# EAGLE design multishift (EAGLE 9.5.1)
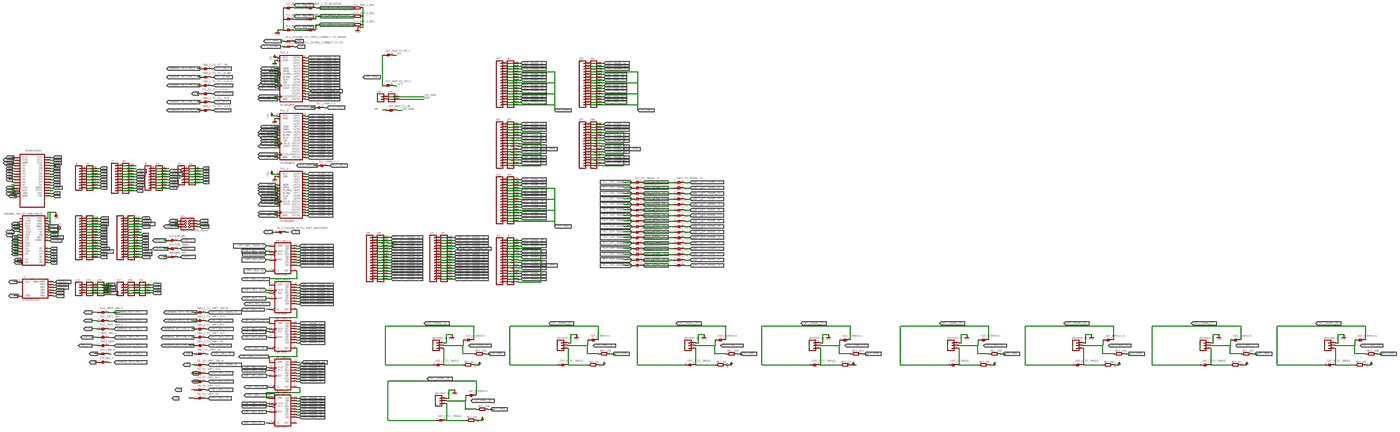
[diagram p0: schematic, sheet 1, overview]
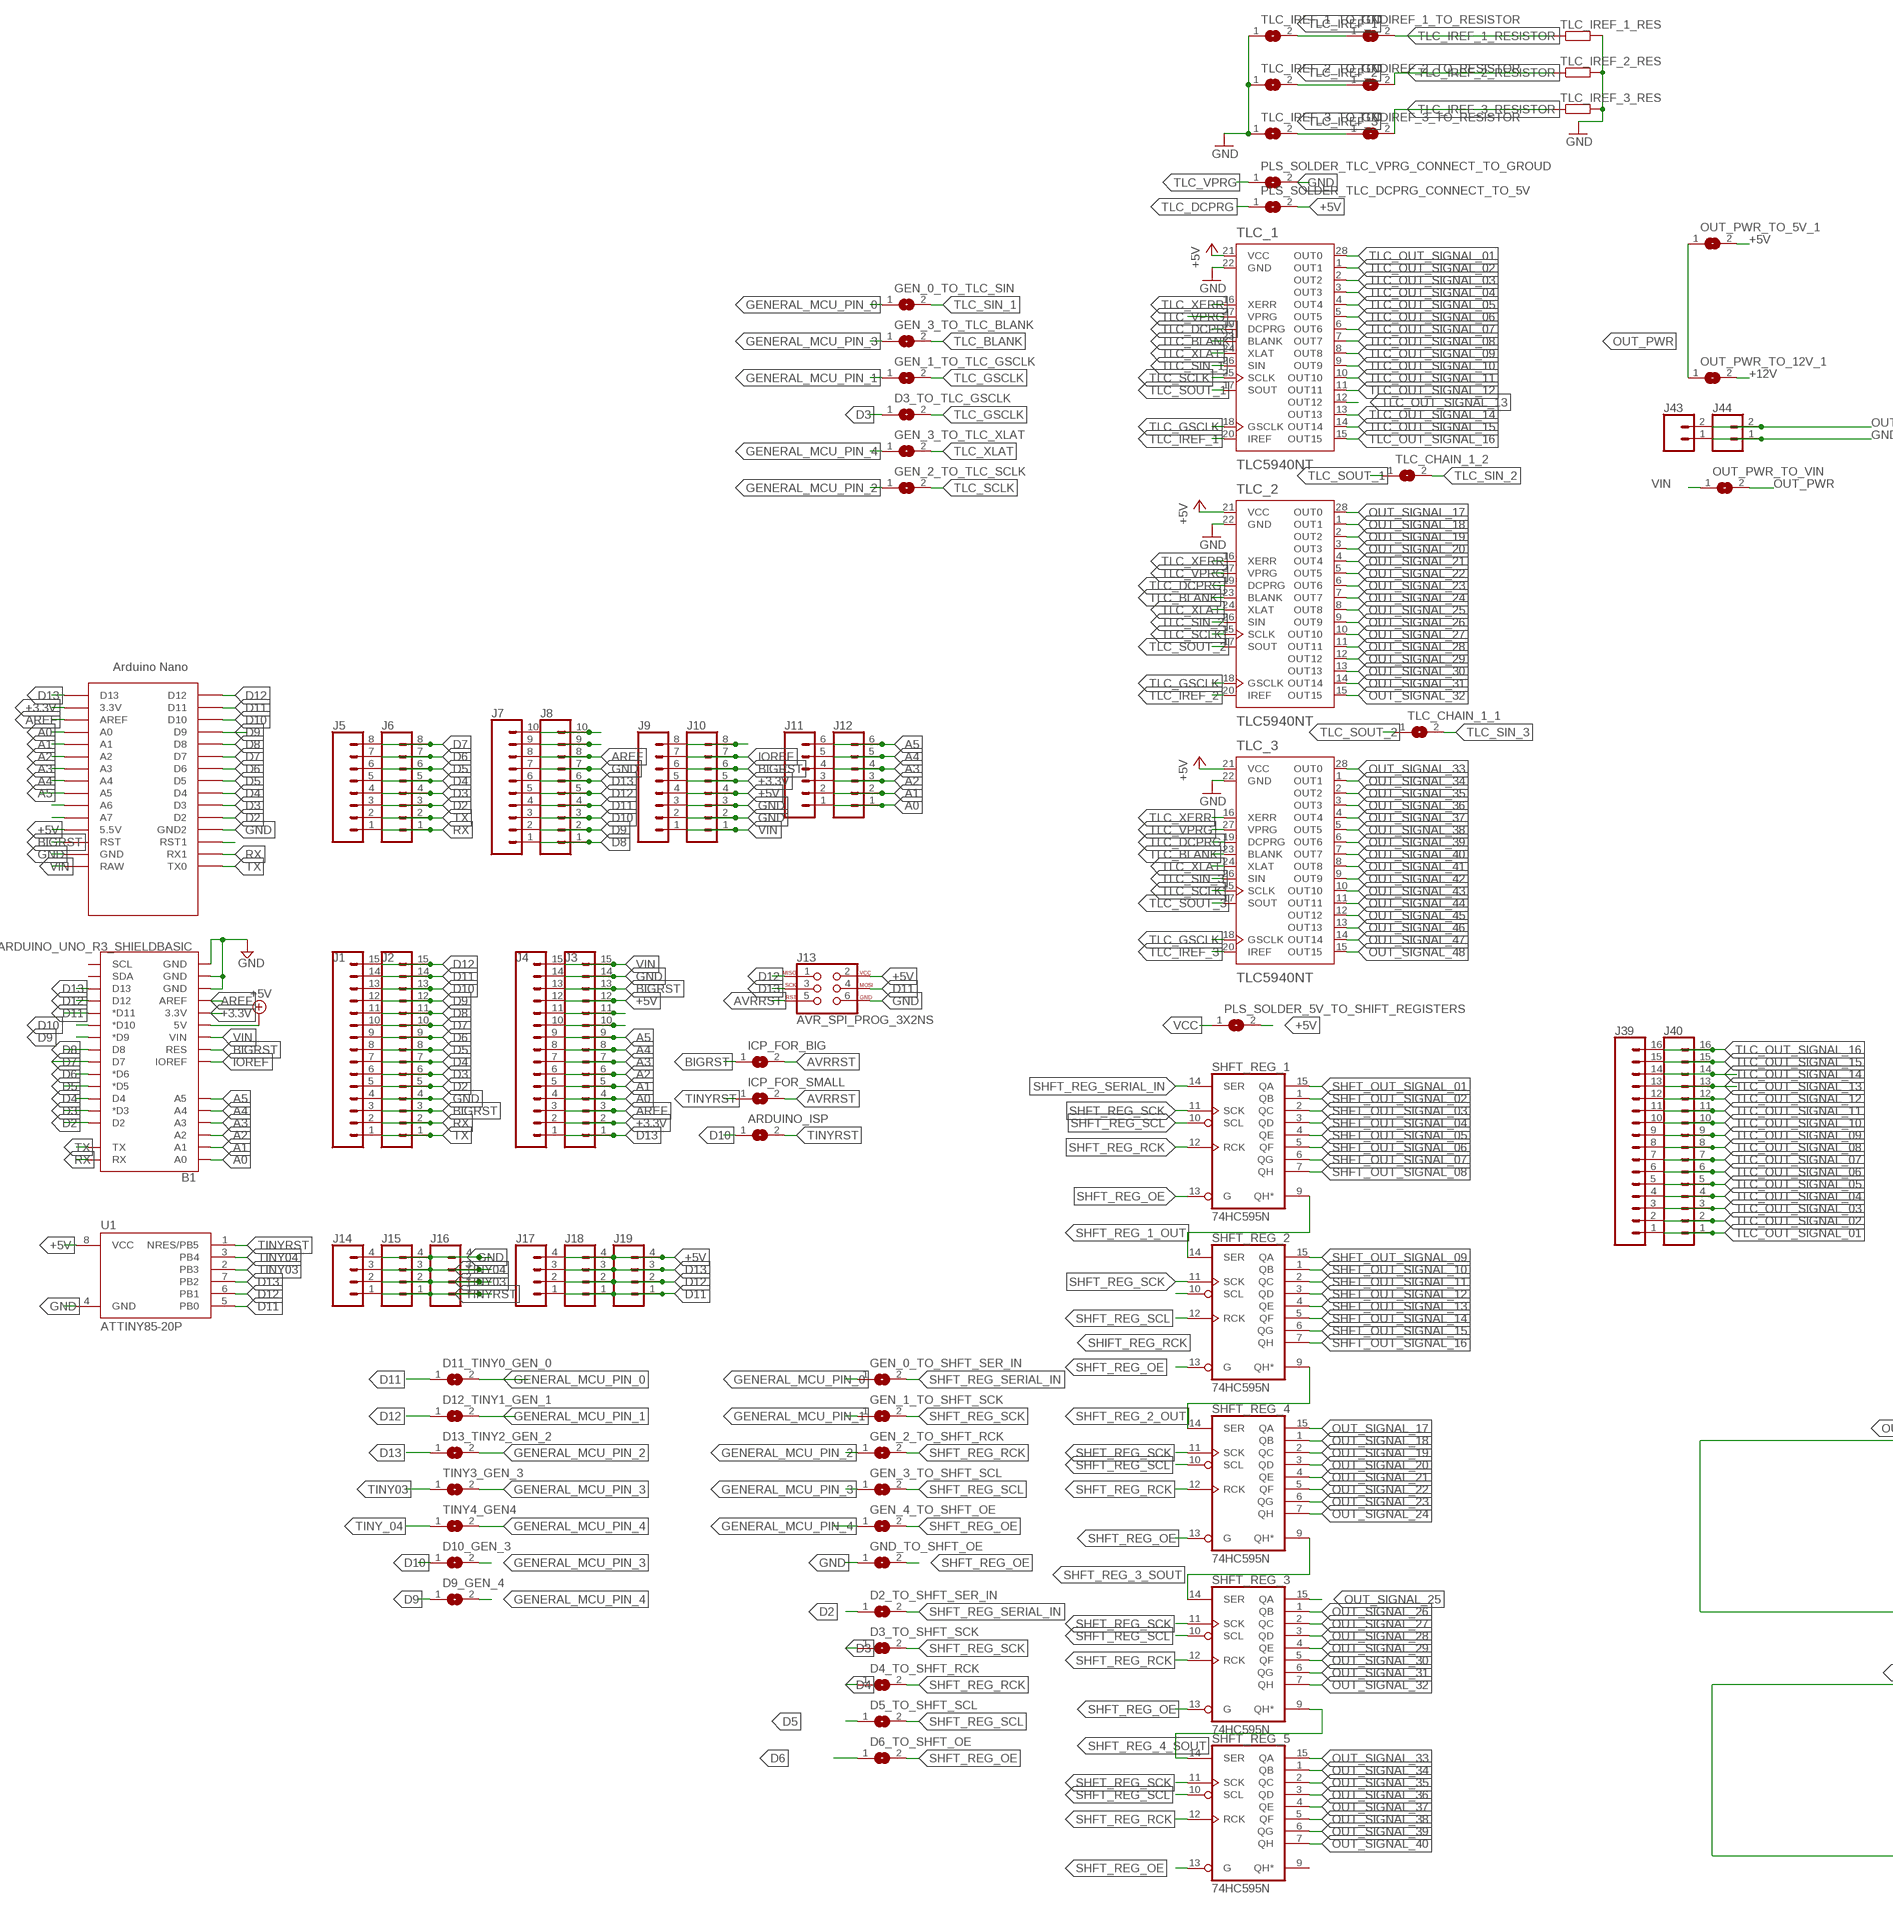
[diagram p1: schematic, sheet 1, part 1 of 4]
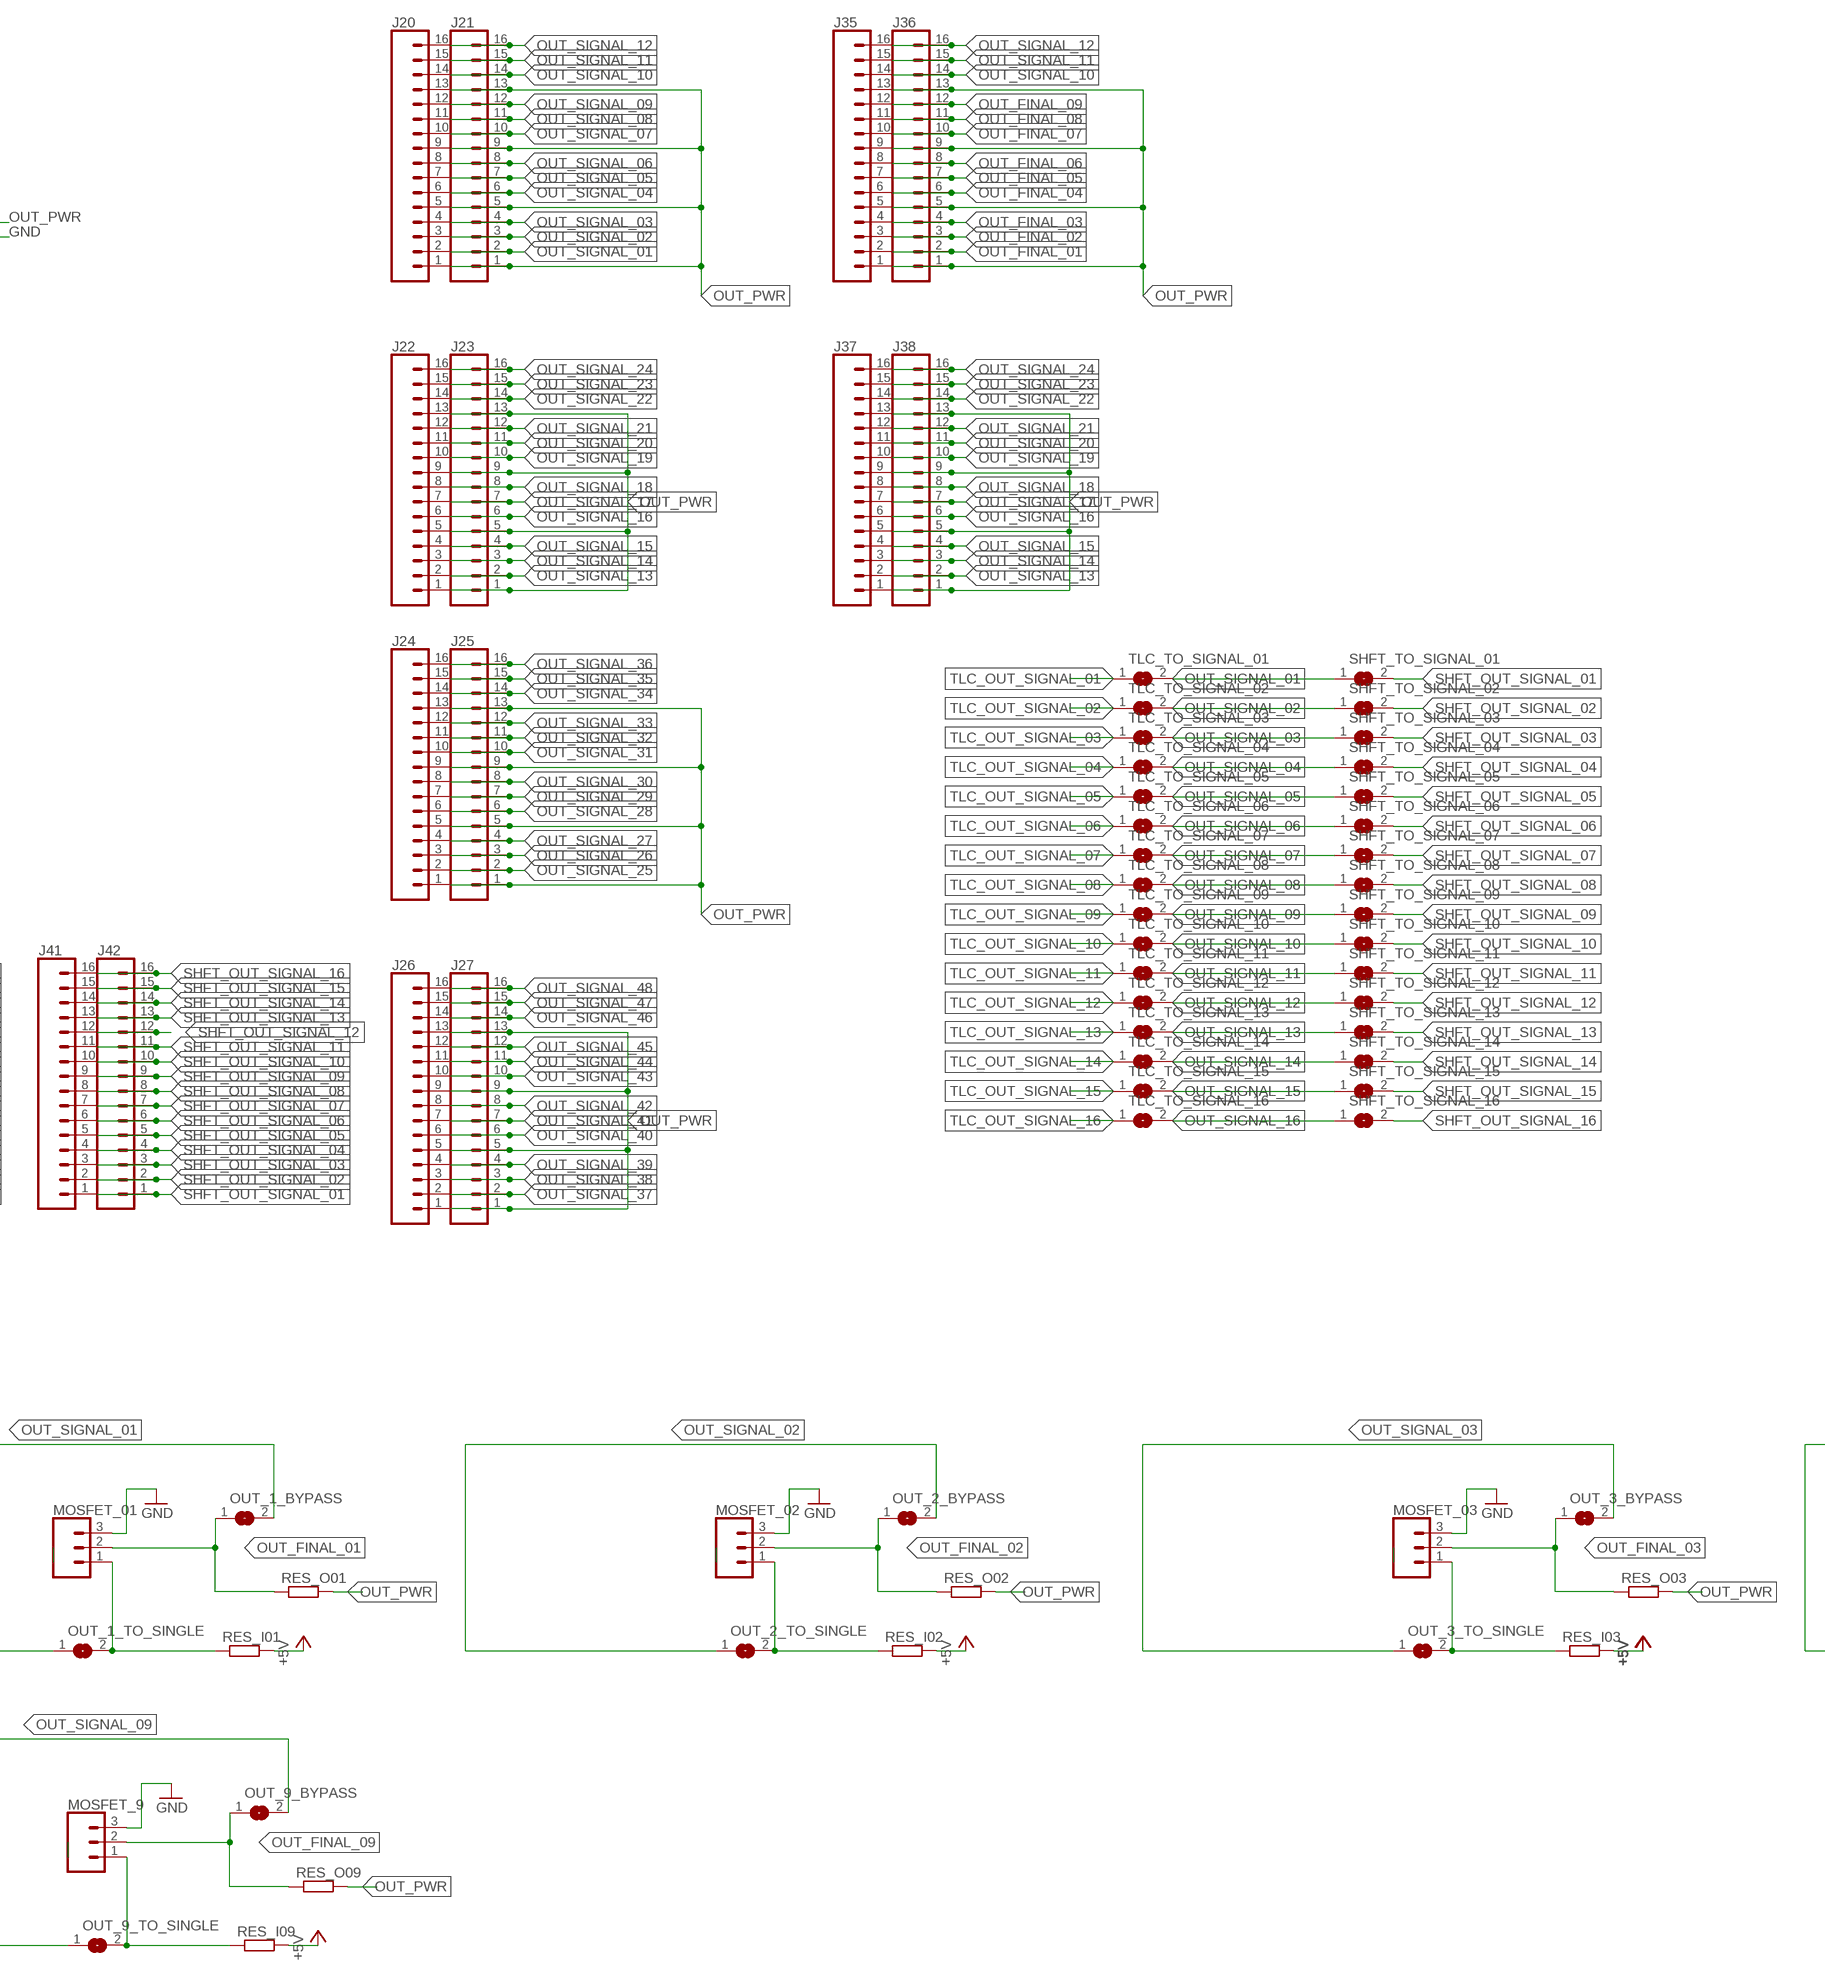
[diagram p2: schematic, sheet 1, part 2 of 4]
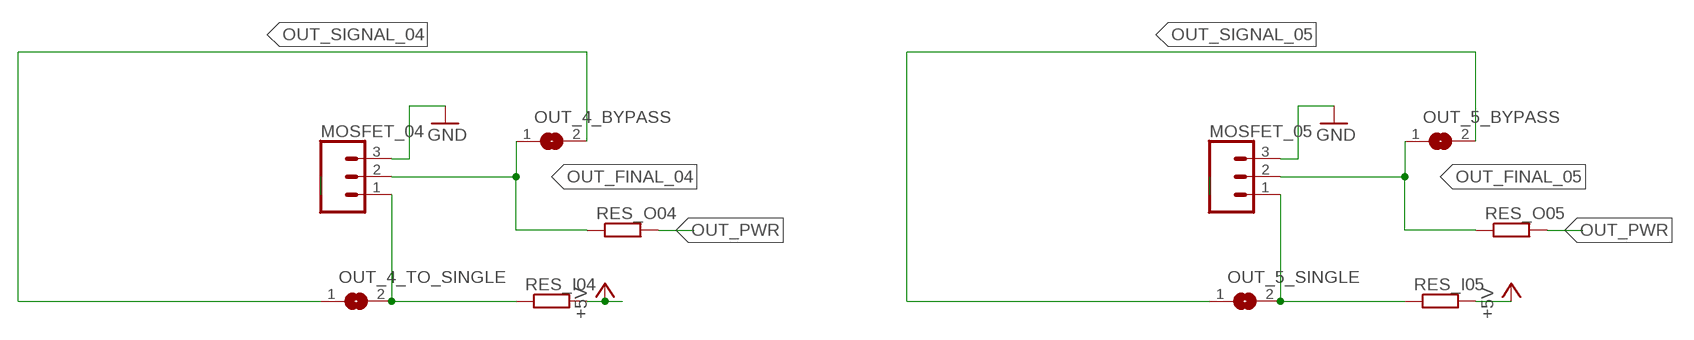
[diagram p3: schematic, sheet 1, part 3 of 4]
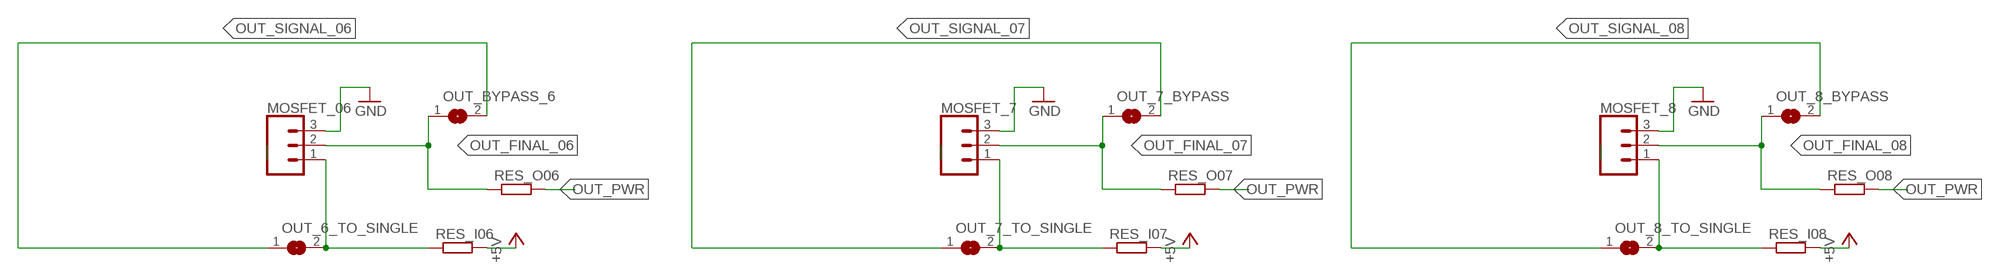
[diagram p4: schematic, sheet 1, part 4 of 4]

## Parts
ARDUINO_ISP  SJ  [SJ]
B1  ARDUINO_UNO_R3_SHIELDBASIC  [UNO_R3_SHIELD]
D2_TO_SHFT_SER_IN  SJ  [SJ]
D3_TO_SHFT_SCK  SJ  [SJ]
D3_TO_TLC_GSCLK  SJ  [SJ]
D4_TO_SHFT_RCK  SJ  [SJ]
D5_TO_SHFT_SCL  SJ  [SJ]
D6_TO_SHFT_OE  SJ  [SJ]
D9_GEN_4  SJ  [SJ]
D10_GEN_3  SJ  [SJ]
D11_TINY0_GEN_0  SJ  [SJ]
D12_TINY1_GEN_1  SJ  [SJ]
D13_TINY2_GEN_2  SJ  [SJ]
GEN_0_TO_SHFT_SER_IN  SJ  [SJ]
GEN_0_TO_TLC_SIN  SJ  [SJ]
GEN_1_TO_SHFT_SCK  SJ  [SJ]
GEN_1_TO_TLC_GSCLK  SJ  [SJ]
GEN_2_TO_SHFT_RCK  SJ  [SJ]
GEN_2_TO_TLC_SCLK  SJ  [SJ]
GEN_3_TO_SHFT_SCL  SJ  [SJ]
GEN_3_TO_TLC_BLANK  SJ  [SJ]
GEN_3_TO_TLC_XLAT  SJ  [SJ]
GEN_4_TO_SHFT_OE  SJ  [SJ]
GND_TO_SHFT_OE  SJ  [SJ]
ICP_FOR_BIG  SJ  [SJ]
ICP_FOR_SMALL  SJ  [SJ]
J1  CONN_15  [1X15]
J2  CONN_15  [1X15]
J3  CONN_15  [1X15]
J4  CONN_15  [1X15]
J5  CONN_08"  [1X08]
J6  CONN_08"  [1X08]
J7  CONN_10"  [1X10]
J8  CONN_10"  [1X10]
J9  CONN_08"  [1X08]
J10  CONN_08"  [1X08]
J11  CONN_06SILK_FEMALE_PTH  [1X06]
J12  CONN_06SILK_FEMALE_PTH  [1X06]
J13  AVR_SPI_PROG_3X2NS  [2X3-NS]
J14  CONN_04  [1X04]
J15  CONN_04  [1X04]
J16  CONN_04  [1X04]
J17  CONN_04  [1X04]
J18  CONN_04  [1X04]
J19  CONN_04  [1X04]
J20  CONN_16  [1X16]
J21  CONN_16  [1X16]
J22  CONN_16  [1X16]
J23  CONN_16  [1X16]
J24  CONN_16  [1X16]
J25  CONN_16  [1X16]
J26  CONN_16  [1X16]
J27  CONN_16  [1X16]
J35  CONN_16  [1X16]
J36  CONN_16  [1X16]
J37  CONN_16  [1X16]
J38  CONN_16  [1X16]
J39  CONN_16  [1X16]
J40  CONN_16  [1X16]
J41  CONN_16  [1X16]
J42  CONN_16  [1X16]
J43  CONN_025MM  [SCREWTERMINAL-5MM-2]
J44  CONN_025MM  [SCREWTERMINAL-5MM-2]
MOSFET_01  CONN_03  [1X03]
MOSFET_02  CONN_03  [1X03]
MOSFET_03  CONN_03  [1X03]
MOSFET_04  CONN_03  [1X03]
MOSFET_05  CONN_03  [1X03]
MOSFET_06  CONN_03  [1X03]
MOSFET_7  CONN_03  [1X03]
MOSFET_8  CONN_03  [1X03]
MOSFET_9  CONN_03  [1X03]
OUT_1_BYPASS  SJ  [SJ]
OUT_1_TO_SINGLE  SJ  [SJ]
OUT_2_BYPASS  SJ  [SJ]
OUT_2_TO_SINGLE  SJ  [SJ]
OUT_3_BYPASS  SJ  [SJ]
OUT_3_TO_SINGLE  SJ  [SJ]
OUT_4_BYPASS  SJ  [SJ]
OUT_4_TO_SINGLE  SJ  [SJ]
OUT_5_BYPASS  SJ  [SJ]
OUT_5_SINGLE  SJ  [SJ]
OUT_6_TO_SINGLE  SJ  [SJ]
OUT_7_BYPASS  SJ  [SJ]
OUT_7_TO_SINGLE  SJ  [SJ]
OUT_8_BYPASS  SJ  [SJ]
OUT_8_TO_SINGLE  SJ  [SJ]
OUT_9_BYPASS  SJ  [SJ]
OUT_9_TO_SINGLE  SJ  [SJ]
OUT_BYPASS_6  SJ  [SJ]
OUT_PWR_TO_5V_1  SJ  [SJ]
OUT_PWR_TO_12V_1  SJ  [SJ]
OUT_PWR_TO_VIN  SJ  [SJ]
PLS_SOLDER_5V_TO_SHIFT_REGISTERS  SJ  [SJ]
PLS_SOLDER_TLC_DCPRG_CONNECT_TO_5V  SJ  [SJ]
PLS_SOLDER_TLC_VPRG_CONNECT_TO_GROUD  SJ  [SJ]
RES_I01  R-EU_0204/7  [0204/7]
RES_I02  R-EU_0204/7  [0204/7]
RES_I03  R-EU_0204/7  [0204/7]
RES_I04  R-EU_0204/7  [0204/7]
RES_I05  R-EU_0204/7  [0204/7]
RES_I06  R-EU_0204/7  [0204/7]
RES_I07  R-EU_0204/7  [0204/7]
RES_I08  R-EU_0204/7  [0204/7]
RES_I09  R-EU_0204/7  [0204/7]
RES_O01  R-EU_0204/7  [0204/7]
RES_O02  R-EU_0204/7  [0204/7]
RES_O03  R-EU_0204/7  [0204/7]
RES_O04  R-EU_0204/7  [0204/7]
RES_O05  R-EU_0204/7  [0204/7]
RES_O06  R-EU_0204/7  [0204/7]
RES_O07  R-EU_0204/7  [0204/7]
RES_O08  R-EU_0204/7  [0204/7]
RES_O09  R-EU_0204/7  [0204/7]
SHFT_REG_1  74HC595N  [DIL16]
SHFT_REG_2  74HC595N  [DIL16]
SHFT_REG_3  74HC595N  [DIL16]
SHFT_REG_4  74HC595N  [DIL16]
SHFT_REG_5  74HC595N  [DIL16]
SHFT_TO_SIGNAL_01  SJ  [SJ]
SHFT_TO_SIGNAL_02  SJ  [SJ]
SHFT_TO_SIGNAL_03  SJ  [SJ]
SHFT_TO_SIGNAL_04  SJ  [SJ]
SHFT_TO_SIGNAL_05  SJ  [SJ]
SHFT_TO_SIGNAL_06  SJ  [SJ]
SHFT_TO_SIGNAL_07  SJ  [SJ]
SHFT_TO_SIGNAL_08  SJ  [SJ]
SHFT_TO_SIGNAL_09  SJ  [SJ]
SHFT_TO_SIGNAL_10  SJ  [SJ]
SHFT_TO_SIGNAL_11  SJ  [SJ]
SHFT_TO_SIGNAL_12  SJ  [SJ]
SHFT_TO_SIGNAL_13  SJ  [SJ]
SHFT_TO_SIGNAL_14  SJ  [SJ]
SHFT_TO_SIGNAL_15  SJ  [SJ]
SHFT_TO_SIGNAL_16  SJ  [SJ]
TINY3_GEN_3  SJ  [SJ]
TINY4_GEN4  SJ  [SJ]
TLC_1  TLC5940NT  [DIL28-3]
TLC_2  TLC5940NT  [DIL28-3]
TLC_3  TLC5940NT  [DIL28-3]
TLC_CHAIN_1_1  SJ  [SJ]
TLC_CHAIN_1_2  SJ  [SJ]
TLC_IREF_1_RES  R-EU_0204/7  [0204/7]
TLC_IREF_1_TO_GND  SJ  [SJ]
TLC_IREF_1_TO_RESISTOR  SJ  [SJ]
TLC_IREF_2_RES  R-EU_0204/7  [0204/7]
TLC_IREF_2_TO_GND  SJ  [SJ]
TLC_IREF_2_TO_RESISTOR  SJ  [SJ]
TLC_IREF_3_RES  R-EU_0204/7  [0204/7]
TLC_IREF_3_TO_GND  SJ  [SJ]
TLC_IREF_3_TO_RESISTOR  SJ  [SJ]
TLC_TO_SIGNAL_01  SJ  [SJ]
TLC_TO_SIGNAL_02  SJ  [SJ]
TLC_TO_SIGNAL_03  SJ  [SJ]
TLC_TO_SIGNAL_04  SJ  [SJ]
TLC_TO_SIGNAL_05  SJ  [SJ]
TLC_TO_SIGNAL_06  SJ  [SJ]
TLC_TO_SIGNAL_07  SJ  [SJ]
TLC_TO_SIGNAL_08  SJ  [SJ]
TLC_TO_SIGNAL_09  SJ  [SJ]
TLC_TO_SIGNAL_10  SJ  [SJ]
TLC_TO_SIGNAL_11  SJ  [SJ]
TLC_TO_SIGNAL_12  SJ  [SJ]
TLC_TO_SIGNAL_13  SJ  [SJ]
TLC_TO_SIGNAL_14  SJ  [SJ]
TLC_TO_SIGNAL_15  SJ  [SJ]
TLC_TO_SIGNAL_16  SJ  [SJ]
U1  ATTINY85-20P  [PDIP08_300MIL]
U$1  NANO  [NANO]

## Nets
+3.3V: B1.3.3V J3.2 J4.2 J9.5 J10.5 U$1.3.3V
+5V: B1.5V J3.12 J4.12 J9.4 J10.4 J13.2 J17.4 J18.4 J19.4 OUT_PWR_TO_5V_1.2 PLS_SOLDER_5V_TO_SHIFT_REGISTERS.2 PLS_SOLDER_TLC_DCPRG_CONNECT_TO_5V.2 RES_I01.2 RES_I02.2 RES_I03.2 RES_I04.2 RES_I05.2 RES_I06.2 RES_I07.2 RES_I08.2 RES_I09.2 TLC_1.21(VCC) TLC_2.21(VCC) TLC_3.21(VCC) U1.8(VCC) U$1.5V(5.5V)
+12V: OUT_PWR_TO_12V_1.2
A0: B1.A0 J3.4 J4.4 J11.1 J12.1 U$1.A0
A1: B1.A1 J3.5 J4.5 J11.2 J12.2 U$1.A1
A2: B1.A2 J3.6 J4.6 J11.3 J12.3 U$1.A2
A3: B1.A3 J3.7 J4.7 J11.4 J12.4 U$1.A3
A4: B1.A4 J3.8 J4.8 J11.5 J12.5 U$1.A4
A5: B1.A5 J3.9 J4.9 J11.6 J12.6 U$1.A5
AREF: B1.AREF J3.3 J4.3 J7.8 J8.8 U$1.AREF
AVRRST: ICP_FOR_BIG.2 ICP_FOR_SMALL.2 J13.5
BIGRST: B1.RES ICP_FOR_BIG.1 J1.3 J2.3 J3.13 J4.13 J9.6 J10.6 U$1.RST
D2: B1.D2 D2_TO_SHFT_SER_IN.1 J1.5 J2.5 J5.3 J6.3 U$1.D2
D3: B1.D3(*D3) D3_TO_SHFT_SCK.1 D3_TO_TLC_GSCLK.1 J1.6 J2.6 J5.4 J6.4 U$1.D3
D4: B1.D4 D4_TO_SHFT_RCK.1 J1.7 J2.7 J5.5 J6.5 U$1.D4
D5: B1.D5(*D5) D5_TO_SHFT_SCL.1 J1.8 J2.8 J5.6 J6.6 U$1.D5
D6: B1.D6(*D6) D6_TO_SHFT_OE.1 J1.9 J2.9 J5.7 J6.7 U$1.D6
D7: B1.D7 J1.10 J2.10 J5.8 J6.8 U$1.D7
D8: B1.D8 J1.11 J2.11 J7.1 J8.1 U$1.D8
D9: B1.D9(*D9) D9_GEN_4.1 J1.12 J2.12 J7.2 J8.2 U$1.D9
D10: ARDUINO_ISP.1 B1.D10(*D10) D10_GEN_3.1 J1.13 J2.13 J7.3 J8.3 U$1.D10
D11: B1.D11(*D11) D11_TINY0_GEN_0.1 J1.14 J2.14 J7.4 J8.4 J13.4 J17.1 J18.1 J19.1 U1.5(PB0) U$1.D11
D12: B1.D12 D12_TINY1_GEN_1.1 J1.15 J2.15 J7.5 J8.5 J13.1 J17.2 J18.2 J19.2 U1.6(PB1) U$1.D12
D13: B1.D13 D13_TINY2_GEN_2.1 J3.1 J4.1 J7.6 J8.6 J13.3 J17.3 J18.3 J19.3 U1.7(PB2) U$1.D13
GENERAL_MCU_PIN_0: D11_TINY0_GEN_0.2 GEN_0_TO_SHFT_SER_IN.1 GEN_0_TO_TLC_SIN.1
GENERAL_MCU_PIN_1: D12_TINY1_GEN_1.2 GEN_1_TO_SHFT_SCK.1 GEN_1_TO_TLC_GSCLK.1
GENERAL_MCU_PIN_2: D13_TINY2_GEN_2.2 GEN_2_TO_SHFT_RCK.1 GEN_2_TO_TLC_SCLK.1
GENERAL_MCU_PIN_3: D10_GEN_3.2 GEN_3_TO_SHFT_SCL.1 GEN_3_TO_TLC_BLANK.1 TINY3_GEN_3.2
GENERAL_MCU_PIN_4: D9_GEN_4.2 GEN_3_TO_TLC_XLAT.1 GEN_4_TO_SHFT_OE.1 TINY4_GEN4.2
GND: B1.GND@0(GND) B1.GND@1(GND) B1.GND@2(GND) GND_TO_SHFT_OE.1 J1.4 J2.4 J3.14 J4.14 J7.7 J8.7 J9.2 J9.3 J10.2 J10.3 J13.6 J14.4 J15.4 J16.4 J43.1 J44.1 MOSFET_01.3 MOSFET_02.3 MOSFET_03.3 MOSFET_04.3 MOSFET_05.3 MOSFET_06.3 MOSFET_7.3 MOSFET_8.3 MOSFET_9.3 PLS_SOLDER_TLC_VPRG_CONNECT_TO_GROUD.2 TLC_1.22(GND) TLC_2.22(GND) TLC_3.22(GND) TLC_IREF_1_RES.2 TLC_IREF_1_TO_GND.1 TLC_IREF_2_RES.2 TLC_IREF_2_TO_GND.1 TLC_IREF_3_RES.2 TLC_IREF_3_TO_GND.1 U1.4(GND) U$1.GND U$1.GND1(GND2)
IOREF: B1.IOREF J9.7 J10.7
N$1: J9.8 J10.8
N$5: J3.11 J4.11
N$6: J3.10 J4.10
N$11: U$1.A6
N$12: U$1.A7
N$14: J7.9 J8.9
N$15: J7.10 J8.10
N$21: U$1.RST1
N$50: MOSFET_01.1 OUT_1_TO_SINGLE.2 RES_I01.1
N$51: MOSFET_9.1 OUT_9_TO_SINGLE.2 RES_I09.1
N$54: MOSFET_02.1 OUT_2_TO_SINGLE.2 RES_I02.1
N$66: MOSFET_03.1 OUT_3_TO_SINGLE.2 RES_I03.1
N$70: MOSFET_04.1 OUT_4_TO_SINGLE.2 RES_I04.1
N$178: MOSFET_05.1 OUT_5_SINGLE.2 RES_I05.1
N$182: MOSFET_06.1 OUT_6_TO_SINGLE.2 RES_I06.1
N$194: MOSFET_7.1 OUT_7_TO_SINGLE.2 RES_I07.1
N$198: MOSFET_8.1 OUT_8_TO_SINGLE.2 RES_I08.1
OUT_FINAL_01: J35.2 J36.2 MOSFET_01.2 OUT_1_BYPASS.1 RES_O01.1
OUT_FINAL_02: J35.3 J36.3 MOSFET_02.2 OUT_2_BYPASS.1 RES_O02.1
OUT_FINAL_03: J35.4 J36.4 MOSFET_03.2 OUT_3_BYPASS.1 RES_O03.1
OUT_FINAL_04: J35.6 J36.6 MOSFET_04.2 OUT_4_BYPASS.1 RES_O04.1
OUT_FINAL_05: J35.7 J36.7 MOSFET_05.2 OUT_5_BYPASS.1 RES_O05.1
OUT_FINAL_06: J35.8 J36.8 MOSFET_06.2 OUT_BYPASS_6.1 RES_O06.1
OUT_FINAL_07: J35.10 J36.10 MOSFET_7.2 OUT_7_BYPASS.1 RES_O07.1
OUT_FINAL_08: J35.11 J36.11 MOSFET_8.2 OUT_8_BYPASS.1 RES_O08.1
OUT_FINAL_09: J35.12 J36.12 MOSFET_9.2 OUT_9_BYPASS.1 RES_O09.1
OUT_PWR: J20.1 J20.5 J20.9 J20.13 J21.1 J21.5 J21.9 J21.13 J22.1 J22.5 J22.9 J22.13 J23.1 J23.5 J23.9 J23.13 J24.1 J24.5 J24.9 J24.13 J25.1 J25.5 J25.9 J25.13 J26.1 J26.5 J26.9 J26.13 J27.1 J27.5 J27.9 J27.13 J35.1 J35.5 J35.9 J35.13 J36.1 J36.5 J36.9 J36.13 J37.1 J37.5 J37.9 J37.13 J38.1 J38.5 J38.9 J38.13 J43.2 J44.2 OUT_PWR_TO_5V_1.1 OUT_PWR_TO_12V_1.1 OUT_PWR_TO_VIN.2 RES_O01.2 RES_O02.2 RES_O03.2 RES_O04.2 RES_O05.2 RES_O06.2 RES_O07.2 RES_O08.2 RES_O09.2
OUT_SIGNAL_01: J20.2 J21.2 OUT_1_BYPASS.2 OUT_1_TO_SINGLE.1 SHFT_TO_SIGNAL_01.1 TLC_TO_SIGNAL_01.2
OUT_SIGNAL_02: J20.3 J21.3 OUT_2_BYPASS.2 OUT_2_TO_SINGLE.1 SHFT_TO_SIGNAL_02.1 TLC_TO_SIGNAL_02.2
OUT_SIGNAL_03: J20.4 J21.4 OUT_3_BYPASS.2 OUT_3_TO_SINGLE.1 SHFT_TO_SIGNAL_03.1 TLC_TO_SIGNAL_03.2
OUT_SIGNAL_04: J20.6 J21.6 OUT_4_BYPASS.2 OUT_4_TO_SINGLE.1 SHFT_TO_SIGNAL_04.1 TLC_TO_SIGNAL_04.2
OUT_SIGNAL_05: J20.7 J21.7 OUT_5_BYPASS.2 OUT_5_SINGLE.1 SHFT_TO_SIGNAL_05.1 TLC_TO_SIGNAL_05.2
OUT_SIGNAL_06: J20.8 J21.8 OUT_6_TO_SINGLE.1 OUT_BYPASS_6.2 SHFT_TO_SIGNAL_06.1 TLC_TO_SIGNAL_06.2
OUT_SIGNAL_07: J20.10 J21.10 OUT_7_BYPASS.2 OUT_7_TO_SINGLE.1 SHFT_TO_SIGNAL_07.1 TLC_TO_SIGNAL_07.2
OUT_SIGNAL_08: J20.11 J21.11 OUT_8_BYPASS.2 OUT_8_TO_SINGLE.1 SHFT_TO_SIGNAL_08.1 TLC_TO_SIGNAL_08.2
OUT_SIGNAL_09: J20.12 J21.12 OUT_9_BYPASS.2 OUT_9_TO_SINGLE.1 SHFT_TO_SIGNAL_09.1 TLC_TO_SIGNAL_09.2
OUT_SIGNAL_10: J20.14 J21.14 J35.14 J36.14 SHFT_TO_SIGNAL_10.1 TLC_TO_SIGNAL_10.2
OUT_SIGNAL_11: J20.15 J21.15 J35.15 J36.15 SHFT_TO_SIGNAL_11.1 TLC_TO_SIGNAL_11.2
OUT_SIGNAL_12: J20.16 J21.16 J35.16 J36.16 SHFT_TO_SIGNAL_12.1 TLC_TO_SIGNAL_12.2
OUT_SIGNAL_13: J22.2 J23.2 J37.2 J38.2 SHFT_TO_SIGNAL_13.1 TLC_TO_SIGNAL_13.2
OUT_SIGNAL_14: J22.3 J23.3 J37.3 J38.3 SHFT_TO_SIGNAL_14.1 TLC_TO_SIGNAL_14.2
OUT_SIGNAL_15: J22.4 J23.4 J37.4 J38.4 SHFT_TO_SIGNAL_15.1 TLC_TO_SIGNAL_15.2
OUT_SIGNAL_16: J22.6 J23.6 J37.6 J38.6 SHFT_TO_SIGNAL_16.1 TLC_TO_SIGNAL_16.2
OUT_SIGNAL_17: J22.7 J23.7 J37.7 J38.7 SHFT_REG_4.15(QA) TLC_2.28(OUT0)
OUT_SIGNAL_18: J22.8 J23.8 J37.8 J38.8 SHFT_REG_4.1(QB) TLC_2.1(OUT1)
OUT_SIGNAL_19: J22.10 J23.10 J37.10 J38.10 SHFT_REG_4.2(QC) TLC_2.2(OUT2)
OUT_SIGNAL_20: J22.11 J23.11 J37.11 J38.11 SHFT_REG_4.3(QD) TLC_2.3(OUT3)
OUT_SIGNAL_21: J22.12 J23.12 J37.12 J38.12 SHFT_REG_4.4(QE) TLC_2.4(OUT4)
OUT_SIGNAL_22: J22.14 J23.14 J37.14 J38.14 SHFT_REG_4.5(QF) TLC_2.5(OUT5)
OUT_SIGNAL_23: J22.15 J23.15 J37.15 J38.15 SHFT_REG_4.6(QG) TLC_2.6(OUT6)
OUT_SIGNAL_24: J22.16 J23.16 J37.16 J38.16 SHFT_REG_4.7(QH) TLC_2.7(OUT7)
OUT_SIGNAL_25: J24.2 J25.2 SHFT_REG_3.15(QA) TLC_2.8(OUT8)
OUT_SIGNAL_26: J24.3 J25.3 SHFT_REG_3.1(QB) TLC_2.9(OUT9)
OUT_SIGNAL_27: J24.4 J25.4 SHFT_REG_3.2(QC) TLC_2.10(OUT10)
OUT_SIGNAL_28: J24.6 J25.6 SHFT_REG_3.3(QD) TLC_2.11(OUT11)
OUT_SIGNAL_29: J24.7 J25.7 SHFT_REG_3.4(QE) TLC_2.12(OUT12)
OUT_SIGNAL_30: J24.8 J25.8 SHFT_REG_3.5(QF) TLC_2.13(OUT13)
OUT_SIGNAL_31: J24.10 J25.10 SHFT_REG_3.6(QG) TLC_2.14(OUT14)
OUT_SIGNAL_32: J24.11 J25.11 SHFT_REG_3.7(QH) TLC_2.15(OUT15)
OUT_SIGNAL_33: J24.12 J25.12 SHFT_REG_5.15(QA) TLC_3.28(OUT0)
OUT_SIGNAL_34: J24.14 J25.14 SHFT_REG_5.1(QB) TLC_3.1(OUT1)
OUT_SIGNAL_35: J24.15 J25.15 SHFT_REG_5.2(QC) TLC_3.2(OUT2)
OUT_SIGNAL_36: J24.16 J25.16 SHFT_REG_5.3(QD) TLC_3.3(OUT3)
OUT_SIGNAL_37: J26.2 J27.2 SHFT_REG_5.4(QE) TLC_3.4(OUT4)
OUT_SIGNAL_38: J26.3 J27.3 SHFT_REG_5.5(QF) TLC_3.5(OUT5)
OUT_SIGNAL_39: J26.4 J27.4 SHFT_REG_5.6(QG) TLC_3.6(OUT6)
OUT_SIGNAL_40: J26.6 J27.6 SHFT_REG_5.7(QH) TLC_3.7(OUT7)
OUT_SIGNAL_41: J26.7 J27.7 TLC_3.8(OUT8)
OUT_SIGNAL_42: J26.8 J27.8 TLC_3.9(OUT9)
OUT_SIGNAL_43: J26.10 J27.10 TLC_3.10(OUT10)
OUT_SIGNAL_44: J26.11 J27.11 TLC_3.11(OUT11)
OUT_SIGNAL_45: J26.12 J27.12 TLC_3.12(OUT12)
OUT_SIGNAL_46: J26.14 J27.14 TLC_3.13(OUT13)
OUT_SIGNAL_47: J26.15 J27.15 TLC_3.14(OUT14)
OUT_SIGNAL_48: J26.16 J27.16 TLC_3.15(OUT15)
RX: B1.RX J1.2 J2.2 J5.1 J6.1 U$1.RX1
SHFT_OUT_SIGNAL_01: J41.1 J42.1 SHFT_REG_1.15(QA) SHFT_TO_SIGNAL_01.2
SHFT_OUT_SIGNAL_02: J41.2 J42.2 SHFT_REG_1.1(QB) SHFT_TO_SIGNAL_02.2
SHFT_OUT_SIGNAL_03: J41.3 J42.3 SHFT_REG_1.2(QC) SHFT_TO_SIGNAL_03.2
SHFT_OUT_SIGNAL_04: J41.4 J42.4 SHFT_REG_1.3(QD) SHFT_TO_SIGNAL_04.2
SHFT_OUT_SIGNAL_05: J41.5 J42.5 SHFT_REG_1.4(QE) SHFT_TO_SIGNAL_05.2
SHFT_OUT_SIGNAL_06: J41.6 J42.6 SHFT_REG_1.5(QF) SHFT_TO_SIGNAL_06.2
SHFT_OUT_SIGNAL_07: J41.7 J42.7 SHFT_REG_1.6(QG) SHFT_TO_SIGNAL_07.2
SHFT_OUT_SIGNAL_08: J41.8 J42.8 SHFT_REG_1.7(QH) SHFT_TO_SIGNAL_08.2
SHFT_OUT_SIGNAL_09: J41.9 J42.9 SHFT_REG_2.15(QA) SHFT_TO_SIGNAL_09.2
SHFT_OUT_SIGNAL_10: J41.10 J42.10 SHFT_REG_2.1(QB) SHFT_TO_SIGNAL_10.2
SHFT_OUT_SIGNAL_11: J41.11 J42.11 SHFT_REG_2.2(QC) SHFT_TO_SIGNAL_11.2
SHFT_OUT_SIGNAL_12: J41.12 J42.12 SHFT_REG_2.3(QD) SHFT_TO_SIGNAL_12.2
SHFT_OUT_SIGNAL_13: J41.13 J42.13 SHFT_REG_2.4(QE) SHFT_TO_SIGNAL_13.2
SHFT_OUT_SIGNAL_14: J41.14 J42.14 SHFT_REG_2.5(QF) SHFT_TO_SIGNAL_14.2
SHFT_OUT_SIGNAL_15: J41.15 J42.15 SHFT_REG_2.6(QG) SHFT_TO_SIGNAL_15.2
SHFT_OUT_SIGNAL_16: J41.16 J42.16 SHFT_REG_2.7(QH) SHFT_TO_SIGNAL_16.2
SHFT_REG_1_OUT: SHFT_REG_1.9(QH*) SHFT_REG_2.14(SER)
SHFT_REG_2_OUT: SHFT_REG_2.9(QH*) SHFT_REG_4.14(SER)
SHFT_REG_3_SOUT: SHFT_REG_3.14(SER) SHFT_REG_4.9(QH*)
SHFT_REG_4_SOUT: SHFT_REG_3.9(QH*) SHFT_REG_5.14(SER)
SHFT_REG_OE: D6_TO_SHFT_OE.2 GEN_4_TO_SHFT_OE.2 GND_TO_SHFT_OE.2 SHFT_REG_1.13(G) SHFT_REG_2.13(G) SHFT_REG_3.13(G) SHFT_REG_4.13(G) SHFT_REG_5.13(G)
SHFT_REG_RCK: D4_TO_SHFT_RCK.2 GEN_2_TO_SHFT_RCK.2 SHFT_REG_1.12(RCK) SHFT_REG_3.12(RCK) SHFT_REG_4.12(RCK) SHFT_REG_5.12(RCK)
SHFT_REG_SCK: D3_TO_SHFT_SCK.2 GEN_1_TO_SHFT_SCK.2 SHFT_REG_1.11(SCK) SHFT_REG_2.11(SCK) SHFT_REG_3.11(SCK) SHFT_REG_4.11(SCK) SHFT_REG_5.11(SCK)
SHFT_REG_SCL: D5_TO_SHFT_SCL.2 GEN_3_TO_SHFT_SCL.2 SHFT_REG_1.10(SCL) SHFT_REG_2.10(SCL) SHFT_REG_3.10(SCL) SHFT_REG_4.10(SCL) SHFT_REG_5.10(SCL)
SHFT_REG_SERIAL_IN: D2_TO_SHFT_SER_IN.2 GEN_0_TO_SHFT_SER_IN.2 SHFT_REG_1.14(SER)
SHIFT_REG_RCK: SHFT_REG_2.12(RCK)
TINY03: J14.2 J15.2 J16.2 TINY3_GEN_3.1 U1.2(PB3)
TINY04: J14.3 J15.3 J16.3 U1.3(PB4)
TINY_04: TINY4_GEN4.1
TINYRST: ARDUINO_ISP.2 ICP_FOR_SMALL.1 J14.1 J15.1 J16.1 U1.1(NRES/PB5)
TLC_BLANK: GEN_3_TO_TLC_BLANK.2 TLC_1.23(BLANK) TLC_2.23(BLANK) TLC_3.23(BLANK)
TLC_DCPRG: PLS_SOLDER_TLC_DCPRG_CONNECT_TO_5V.1 TLC_1.19(DCPRG) TLC_2.19(DCPRG) TLC_3.19(DCPRG)
TLC_GSCLK: D3_TO_TLC_GSCLK.2 GEN_1_TO_TLC_GSCLK.2 TLC_1.18(GSCLK) TLC_2.18(GSCLK) TLC_3.18(GSCLK)
TLC_IREF_1: TLC_1.20(IREF) TLC_IREF_1_TO_GND.2 TLC_IREF_1_TO_RESISTOR.1
TLC_IREF_1_RESISTOR: TLC_IREF_1_RES.1 TLC_IREF_1_TO_RESISTOR.2
TLC_IREF_2: TLC_2.20(IREF) TLC_IREF_2_TO_GND.2 TLC_IREF_2_TO_RESISTOR.1
TLC_IREF_2_RESISTOR: TLC_IREF_2_RES.1 TLC_IREF_2_TO_RESISTOR.2
TLC_IREF_3: TLC_3.20(IREF) TLC_IREF_3_TO_GND.2 TLC_IREF_3_TO_RESISTOR.1
TLC_IREF_3_RESISTOR: TLC_IREF_3_RES.1 TLC_IREF_3_TO_RESISTOR.2
TLC_OUT_SIGNAL_01: J39.1 J40.1 TLC_1.28(OUT0) TLC_TO_SIGNAL_01.1
TLC_OUT_SIGNAL_02: J39.2 J40.2 TLC_1.1(OUT1) TLC_TO_SIGNAL_02.1
TLC_OUT_SIGNAL_03: J39.3 J40.3 TLC_1.2(OUT2) TLC_TO_SIGNAL_03.1
TLC_OUT_SIGNAL_04: J39.4 J40.4 TLC_1.3(OUT3) TLC_TO_SIGNAL_04.1
TLC_OUT_SIGNAL_05: J39.5 J40.5 TLC_1.4(OUT4) TLC_TO_SIGNAL_05.1
TLC_OUT_SIGNAL_06: J39.6 J40.6 TLC_1.5(OUT5) TLC_TO_SIGNAL_06.1
TLC_OUT_SIGNAL_07: J39.7 J40.7 TLC_1.6(OUT6) TLC_TO_SIGNAL_07.1
TLC_OUT_SIGNAL_08: J39.8 J40.8 TLC_1.7(OUT7) TLC_TO_SIGNAL_08.1
TLC_OUT_SIGNAL_09: J39.9 J40.9 TLC_1.8(OUT8) TLC_TO_SIGNAL_09.1
TLC_OUT_SIGNAL_10: J39.10 J40.10 TLC_1.9(OUT9) TLC_TO_SIGNAL_10.1
TLC_OUT_SIGNAL_11: J39.11 J40.11 TLC_1.10(OUT10) TLC_TO_SIGNAL_11.1
TLC_OUT_SIGNAL_12: J39.12 J40.12 TLC_1.11(OUT11) TLC_TO_SIGNAL_12.1
TLC_OUT_SIGNAL_13: J39.13 J40.13 TLC_1.12(OUT12) TLC_TO_SIGNAL_13.1
TLC_OUT_SIGNAL_14: J39.14 J40.14 TLC_1.13(OUT13) TLC_TO_SIGNAL_14.1
TLC_OUT_SIGNAL_15: J39.15 J40.15 TLC_1.14(OUT14) TLC_TO_SIGNAL_15.1
TLC_OUT_SIGNAL_16: J39.16 J40.16 TLC_1.15(OUT15) TLC_TO_SIGNAL_16.1
TLC_SCLK: GEN_2_TO_TLC_SCLK.2 TLC_1.25(SCLK) TLC_2.25(SCLK) TLC_3.25(SCLK)
TLC_SIN_1: GEN_0_TO_TLC_SIN.2 TLC_1.26(SIN)
TLC_SIN_2: TLC_2.26(SIN) TLC_CHAIN_1_2.2
TLC_SIN_3: TLC_3.26(SIN) TLC_CHAIN_1_1.2
TLC_SOUT_1: TLC_1.17(SOUT) TLC_CHAIN_1_2.1
TLC_SOUT_2: TLC_2.17(SOUT) TLC_CHAIN_1_1.1
TLC_SOUT_3: TLC_3.17(SOUT)
TLC_VPRG: PLS_SOLDER_TLC_VPRG_CONNECT_TO_GROUD.1 TLC_1.27(VPRG) TLC_2.27(VPRG) TLC_3.27(VPRG)
TLC_XERR: TLC_1.16(XERR) TLC_2.16(XERR) TLC_3.16(XERR)
TLC_XLAT: GEN_3_TO_TLC_XLAT.2 TLC_1.24(XLAT) TLC_2.24(XLAT) TLC_3.24(XLAT)
TX: B1.TX J1.1 J2.1 J5.2 J6.2 U$1.TX0
VCC: PLS_SOLDER_5V_TO_SHIFT_REGISTERS.1
VIN: B1.VIN J3.15 J4.15 J9.1 J10.1 OUT_PWR_TO_VIN.1 U$1.RAW
Unconnected: B1.SCL B1.SDA SHFT_REG_5.9(QH*) U$1.ICSP1 U$1.ICSP2 U$1.ICSP3 U$1.ICSP4 U$1.ICSP5 U$1.ICSP6

## Power pins joined to a net without a drawn wire
GND: SHFT_REG_1.8(GND) SHFT_REG_2.8(GND) SHFT_REG_3.8(GND) SHFT_REG_4.8(GND) SHFT_REG_5.8(GND)
VCC: SHFT_REG_1.16(VCC) SHFT_REG_2.16(VCC) SHFT_REG_3.16(VCC) SHFT_REG_4.16(VCC) SHFT_REG_5.16(VCC)

## Library data of the parts
ARDUINO_ISP D2_TO_SHFT_SER_IN D3_TO_SHFT_SCK D3_TO_TLC_GSCLK D4_TO_SHFT_RCK D5_TO_SHFT_SCL D6_TO_SHFT_OE D9_GEN_4 D10_GEN_3 D11_TINY0_GEN_0 D12_TINY1_GEN_1 D13_TINY2_GEN_2 GEN_0_TO_SHFT_SER_IN GEN_0_TO_TLC_SIN GEN_1_TO_SHFT_SCK GEN_1_TO_TLC_GSCLK GEN_2_TO_SHFT_RCK GEN_2_TO_TLC_SCLK GEN_3_TO_SHFT_SCL GEN_3_TO_TLC_BLANK GEN_3_TO_TLC_XLAT GEN_4_TO_SHFT_OE GND_TO_SHFT_OE ICP_FOR_BIG ICP_FOR_SMALL OUT_1_BYPASS OUT_1_TO_SINGLE OUT_2_BYPASS OUT_2_TO_SINGLE OUT_3_BYPASS OUT_3_TO_SINGLE OUT_4_BYPASS OUT_4_TO_SINGLE OUT_5_BYPASS OUT_5_SINGLE OUT_6_TO_SINGLE OUT_7_BYPASS OUT_7_TO_SINGLE OUT_8_BYPASS OUT_8_TO_SINGLE OUT_9_BYPASS OUT_9_TO_SINGLE OUT_BYPASS_6 OUT_PWR_TO_5V_1 OUT_PWR_TO_12V_1 OUT_PWR_TO_VIN PLS_SOLDER_5V_TO_SHIFT_REGISTERS PLS_SOLDER_TLC_DCPRG_CONNECT_TO_5V PLS_SOLDER_TLC_VPRG_CONNECT_TO_GROUD SHFT_TO_SIGNAL_01-SHFT_TO_SIGNAL_09 SHFT_TO_SIGNAL_10-SHFT_TO_SIGNAL_16 TINY3_GEN_3 TINY4_GEN4 TLC_CHAIN_1_1 TLC_CHAIN_1_2 TLC_IREF_1_TO_GND TLC_IREF_1_TO_RESISTOR TLC_IREF_2_TO_GND TLC_IREF_2_TO_RESISTOR TLC_IREF_3_TO_GND TLC_IREF_3_TO_RESISTOR TLC_TO_SIGNAL_01-TLC_TO_SIGNAL_09 TLC_TO_SIGNAL_10-TLC_TO_SIGNAL_16 = jumper:SJ: SMD solder JUMPER
B1 = SparkFun-Boards:ARDUINO_UNO_R3_SHIELD: Arduino R3 Shield Footprint Shield form compatible with the Arduino Uno R3. SparkFun Products: MG2639 Cellular Shield <https://www.sparkfun.com/products/13120> MIDI Shield <https://www.sparkfun.com/products/12898> R3 Stackable Headers Kit <https://www.sparkfun.com/products/11417>
J1-J4 = SparkFun-Connectors:CONN_15: Multi connection point. Often used as Generic Header-pin footprint for 0.1 inch spaced/style header connections On any of the 0.1 inch spaced packages, you can populate with these: Break Away Headers - Straight <https://www.sparkfun.com/products/116> (PRT-00116) Break Away Male Headers - Right Angle <https://www.sparkfun.com/products/553> (PRT-00553) Female Headers <https://www.sparkfun.com/products/115> (PRT-00115) Break Away Headers - Machine Pin <https://www.sparkfun.com/products/117> (PRT-00117) Break Away Female Headers - Swiss Machine Pin <https://www.sparkfun.com/products/743> (PRT-00743) For SCREWTERMINALS and SPRING TERMINALS visit here: Screw Terimnals on SparkFun.com <https://www.sparkfun.com/search/results?term=Screw+Terminals> (5mm/3.5mm/2.54mm spacing) This device is also useful as a general connection point to wire up your design to another part of your project. Our various solder wires solder well into these plated through hole pads. Hook-Up Wire - Assortment (Stranded, 22 AWG) <https://www.sparkfun.com/products/11375> (PRT-11375) Hook-Up Wire - Assortment (Solid Core, 22 AWG) <https://www.sparkfun.com/products/11367> (PRT-11367) View the entire wire category on our website here <https://www.sparkfun.com/categories/141> Special notes: Molex polarized connector foot print use with SKU : PRT-08231 with associated crimp pins and housings. 1MM SMD Version SKU: PRT-10208 NOTES ON THE VARIANTS LOCK and LOCK_LONGPADS... This footprint was designed to help hold the alignment of a through-hole component (i.e. 6-pin header) while soldering it into place. You may notice that each hole has been shifted either up or down by 0.005 of an inch from it's more standard position (which is a perfectly straight line). This slight alteration caused the pins (the squares in the middle) to touch the edges of the holes. Because they are alternating, it causes a "brace" to hold the component in place. 0.005 has proven to be the perfect amount of "off-center" position when using our standard breakaway headers. Although looks a little odd when you look at the bare footprint, once you have a header in there, the alteration is very hard to notice. Also,if you push a header all the way into place, it is covered up entirely on the bottom side.
J5 J6 J9 J10 = SparkFun-Connectors:CONN_08: Multi connection point. Often used as Generic Header-pin footprint for 0.1 inch spaced/style header connections On any of the 0.1 inch spaced packages, you can populate with these: Break Away Headers - Straight <https://www.sparkfun.com/products/116> (PRT-00116) Break Away Male Headers - Right Angle <https://www.sparkfun.com/products/553> (PRT-00553) Female Headers <https://www.sparkfun.com/products/115> (PRT-00115) Break Away Headers - Machine Pin <https://www.sparkfun.com/products/117> (PRT-00117) Break Away Female Headers - Swiss Machine Pin <https://www.sparkfun.com/products/743> (PRT-00743) Arduino Stackable Header - 8 Pin <https://www.sparkfun.com/products/9279> (PRT-09279) For SCREWTERMINALS and SPRING TERMINALS visit here: Screw Terimnals on SparkFun.com <https://www.sparkfun.com/search/results?term=Screw+Terminals> (5mm/3.5mm/2.54mm spacing) This device is also useful as a general connection point to wire up your design to another part of your project. Our various solder wires solder well into these plated through hole pads. Hook-Up Wire - Assortment (Stranded, 22 AWG) <https://www.sparkfun.com/products/11375> (PRT-11375) Hook-Up Wire - Assortment (Solid Core, 22 AWG) <https://www.sparkfun.com/products/11367> (PRT-11367) View the entire wire category on our website here <https://www.sparkfun.com/categories/141> Special notes: Molex polarized connector foot print use with SKU : PRT-08231 with associated crimp pins and housings. 1MM SMD Version SKU: PRT-10208 NOTES ON THE VARIANTS LOCK and LOCK_LONGPADS... This footprint was designed to help hold the alignment of a through-hole component (i.e. 6-pin header) while soldering it into place. You may notice that each hole has been shifted either up or down by 0.005 of an inch from it's more standard position (which is a perfectly straight line). This slight alteration caused the pins (the squares in the middle) to touch the edges of the holes. Because they are alternating, it causes a "brace" to hold the component in place. 0.005 has proven to be the perfect amount of "off-center" position when using our standard breakaway headers. Although looks a little odd when you look at the bare footprint, once you have a header in there, the alteration is very hard to notice. Also,if you push a header all the way into place, it is covered up entirely on the bottom side.; PROD_ID: CONN-08438
J7 J8 = SparkFun-Connectors:CONN_10: Multi connection point. Often used as Generic Header-pin footprint for 0.1 inch spaced/style header connections On any of the 0.1 inch spaced packages, you can populate with these: Break Away Headers - Straight <https://www.sparkfun.com/products/116> (PRT-00116) Break Away Male Headers - Right Angle <https://www.sparkfun.com/products/553> (PRT-00553) Female Headers <https://www.sparkfun.com/products/115> (PRT-00115) Break Away Headers - Machine Pin <https://www.sparkfun.com/products/117> (PRT-00117) Break Away Female Headers - Swiss Machine Pin <https://www.sparkfun.com/products/743> (PRT-00743) Arduino Stackable Header - 10 Pin <https://www.sparkfun.com/products/11376> (PRT-11376) For SCREWTERMINALS and SPRING TERMINALS visit here: Screw Terimnals on SparkFun.com <https://www.sparkfun.com/search/results?term=Screw+Terminals> (5mm/3.5mm/2.54mm spacing) This device is also useful as a general connection point to wire up your design to another part of your project. Our various solder wires solder well into these plated through hole pads. Hook-Up Wire - Assortment (Stranded, 22 AWG) <https://www.sparkfun.com/products/11375> (PRT-11375) Hook-Up Wire - Assortment (Solid Core, 22 AWG) <https://www.sparkfun.com/products/11367> (PRT-11367) View the entire wire category on our website here <https://www.sparkfun.com/categories/141> Special notes: Molex polarized connector foot print use with SKU : PRT-08231 with associated crimp pins and housings. 1MM SMD Version SKU: PRT-10208 NOTES ON THE VARIANTS LOCK and LOCK_LONGPADS... This footprint was designed to help hold the alignment of a through-hole component (i.e. 6-pin header) while soldering it into place. You may notice that each hole has been shifted either up or down by 0.005 of an inch from it's more standard position (which is a perfectly straight line). This slight alteration caused the pins (the squares in the middle) to touch the edges of the holes. Because they are alternating, it causes a "brace" to hold the component in place. 0.005 has proven to be the perfect amount of "off-center" position when using our standard breakaway headers. Although looks a little odd when you look at the bare footprint, once you have a header in there, the alteration is very hard to notice. Also,if you push a header all the way into place, it is covered up entirely on the bottom side.; PROD_ID: CONN-11563
J11 J12 = SparkFun-Connectors:CONN_06: Multi connection point. Often used as Generic Header-pin footprint for 0.1 inch spaced/style header connections On any of the 0.1 inch spaced packages, you can populate with these: Break Away Headers - Straight <https://www.sparkfun.com/products/116> (PRT-00116) Break Away Male Headers - Right Angle <https://www.sparkfun.com/products/553> (PRT-00553) Female Headers <https://www.sparkfun.com/products/115> (PRT-00115) Break Away Headers - Machine Pin <https://www.sparkfun.com/products/117> (PRT-00117) Break Away Female Headers - Swiss Machine Pin <https://www.sparkfun.com/products/743> (PRT-00743) Arduino Stackable Header - 6 Pin <https://www.sparkfun.com/products/9280> (PRT-09280) For SCREWTERMINALS and SPRING TERMINALS visit here: Screw Terimnals on SparkFun.com <https://www.sparkfun.com/search/results?term=Screw+Terminals> (5mm/3.5mm/2.54mm spacing) This device is also useful as a general connection point to wire up your design to another part of your project. Our various solder wires solder well into these plated through hole pads. Hook-Up Wire - Assortment (Stranded, 22 AWG) <https://www.sparkfun.com/products/11375> (PRT-11375) Hook-Up Wire - Assortment (Solid Core, 22 AWG) <https://www.sparkfun.com/products/11367> (PRT-11367) View the entire wire category on our website here <https://www.sparkfun.com/categories/141>; PROD_ID: CONN-08437
J13 = SparkFun-Connectors:AVR_SPI_PROG_3X2: AVR ISP 6 Pin This is the reduced ISP connector for AVR programming. Common on Arduino. This footprint will take up less PCB space and can be used with a 10-pin to 6-pin adapter such as SKU: BOB-08508 **Special note about "TEST_POINT" package. The stop mask is on the top side, so if you want your programming test points to be on the bottom of your board, make sure to place this package on the bottom side of the board. This also ensure that the orientation to program from the bottom side will be correct. SparkFun Products: SparkFun ISP Pogo Adapter <https://www.sparkfun.com/products/11591> - NS Tiny AVR Programmer <https://www.sparkfun.com/products/11801> -PTH
J14-J19 = SparkFun-Connectors:CONN_04: Multi connection point. Often used as Generic Header-pin footprint for 0.1 inch spaced/style header connections On any of the 0.1 inch spaced packages, you can populate with these: Break Away Headers - Straight <https://www.sparkfun.com/products/116> (PRT-00116) Break Away Male Headers - Right Angle <https://www.sparkfun.com/products/553> (PRT-00553) Female Headers <https://www.sparkfun.com/products/115> (PRT-00115) Break Away Headers - Machine Pin <https://www.sparkfun.com/products/117> (PRT-00117) Break Away Female Headers - Swiss Machine Pin <https://www.sparkfun.com/products/743> (PRT-00743) For SCREWTERMINALS and SPRING TERMINALS visit here: Screw Terimnals on SparkFun.com <https://www.sparkfun.com/search/results?term=Screw+Terminals> (5mm/3.5mm/2.54mm spacing) This device is also useful as a general connection point to wire up your design to another part of your project. Our various solder wires solder well into these plated through hole pads. Hook-Up Wire - Assortment (Stranded, 22 AWG) <https://www.sparkfun.com/products/11375> (PRT-11375) Hook-Up Wire - Assortment (Solid Core, 22 AWG) <https://www.sparkfun.com/products/11367> (PRT-11367) View the entire wire category on our website here <https://www.sparkfun.com/categories/141> Special notes: Molex polarized connector foot print use with SKU : PRT-08231 with associated crimp pins and housings. 1MM SMD Version SKU: PRT-10208; PROD_ID: CONN-09696
J20-J27 J35-J42 = SparkFun-Connectors:CONN_16: Multi connection point. Often used as Generic Header-pin footprint for 0.1 inch spaced/style header connections On any of the 0.1 inch spaced packages, you can populate with these: Break Away Headers - Straight <https://www.sparkfun.com/products/116> (PRT-00116) Break Away Male Headers - Right Angle <https://www.sparkfun.com/products/553> (PRT-00553) Female Headers <https://www.sparkfun.com/products/115> (PRT-00115) Break Away Headers - Machine Pin <https://www.sparkfun.com/products/117> (PRT-00117) Break Away Female Headers - Swiss Machine Pin <https://www.sparkfun.com/products/743> (PRT-00743) For SCREWTERMINALS and SPRING TERMINALS visit here: Screw Terimnals on SparkFun.com <https://www.sparkfun.com/search/results?term=Screw+Terminals> (5mm/3.5mm/2.54mm spacing) This device is also useful as a general connection point to wire up your design to another part of your project. Our various solder wires solder well into these plated through hole pads. Hook-Up Wire - Assortment (Stranded, 22 AWG) <https://www.sparkfun.com/products/11375> (PRT-11375) Hook-Up Wire - Assortment (Solid Core, 22 AWG) <https://www.sparkfun.com/products/11367> (PRT-11367) View the entire wire category on our website here <https://www.sparkfun.com/categories/141> Special notes: Molex polarized connector foot print use with SKU : PRT-08231 with associated crimp pins and housings. 1MM SMD Version SKU: PRT-10208 NOTES ON THE VARIANTS LOCK and LOCK_LONGPADS... This footprint was designed to help hold the alignment of a through-hole component (i.e. 6-pin header) while soldering it into place. You may notice that each hole has been shifted either up or down by 0.005 of an inch from it's more standard position (which is a perfectly straight line). This slight alteration caused the pins (the squares in the middle) to touch the edges of the holes. Because they are alternating, it causes a "brace" to hold the component in place. 0.005 has proven to be the perfect amount of "off-center" position when using our standard breakaway headers. Although looks a little odd when you look at the bare footprint, once you have a header in there, the alteration is very hard to notice. Also,if you push a header all the way into place, it is covered up entirely on the bottom side.
J43 J44 = SparkFun-Connectors:CONN_02: Multi connection point. Often used as Generic Header-pin footprint for 0.1 inch spaced/style header connections On any of the 0.1 inch spaced packages, you can populate with these: Break Away Headers - Straight <https://www.sparkfun.com/products/116> (PRT-00116) Break Away Male Headers - Right Angle <https://www.sparkfun.com/products/553> (PRT-00553) Female Headers <https://www.sparkfun.com/products/115> (PRT-00115) Break Away Headers - Machine Pin <https://www.sparkfun.com/products/117> (PRT-00117) Break Away Female Headers - Swiss Machine Pin <https://www.sparkfun.com/products/743> (PRT-00743) For SCREWTERMINALS and SPRING TERMINALS visit here: Screw Terimnals on SparkFun.com <https://www.sparkfun.com/search/results?term=Screw+Terminals> (5mm/3.5mm/2.54mm spacing) This device is also useful as a general connection point to wire up your design to another part of your project. Our various solder wires solder well into these plated through hole pads. Hook-Up Wire - Assortment (Stranded, 22 AWG) <https://www.sparkfun.com/products/11375> (PRT-11375) Hook-Up Wire - Assortment (Solid Core, 22 AWG) <https://www.sparkfun.com/products/11367> (PRT-11367) View the entire wire category on our website here <https://www.sparkfun.com/categories/141> Special notes: Molex polarized connector foot print use with: PRT-08233 with associated crimp pins and housings. 2.54_SCREWTERM for use with PRT-10571. 3.5mm Screw Terminal footprints for PRT-08084 5mm Screw Terminal footprints for use with PRT-08432; SF_SKU: PRT-08432
MOSFET_01-MOSFET_06 MOSFET_7-MOSFET_9 = SparkFun-Connectors:CONN_03: Multi connection point. Often used as Generic Header-pin footprint for 0.1 inch spaced/style header connections On any of the 0.1 inch spaced packages, you can populate with these: Break Away Headers - Straight <https://www.sparkfun.com/products/116> (PRT-00116) Break Away Male Headers - Right Angle <https://www.sparkfun.com/products/553> (PRT-00553) Female Headers <https://www.sparkfun.com/products/115> (PRT-00115) Break Away Headers - Machine Pin <https://www.sparkfun.com/products/117> (PRT-00117) Break Away Female Headers - Swiss Machine Pin <https://www.sparkfun.com/products/743> (PRT-00743) Stackable Header - 3 Pin (Female, 0.1") <https://www.sparkfun.com/products/13875> (PRT-13875) For SCREWTERMINALS and SPRING TERMINALS visit here: Screw Terimnals on SparkFun.com <https://www.sparkfun.com/search/results?term=Screw+Terminals> (5mm/3.5mm/2.54mm spacing) This device is also useful as a general connection point to wire up your design to another part of your project. Our various solder wires solder well into these plated through hole pads. Hook-Up Wire - Assortment (Stranded, 22 AWG) <https://www.sparkfun.com/products/11375> (PRT-11375) Hook-Up Wire - Assortment (Solid Core, 22 AWG) <https://www.sparkfun.com/products/11367> (PRT-11367) View the entire wire category on our website here <https://www.sparkfun.com/categories/141> Special notes: Molex polarized connector foot print use with SKU : PRT-08232 with associated crimp pins and housings.
RES_I01-RES_I09 RES_O01-RES_O09 TLC_IREF_1_RES TLC_IREF_2_RES TLC_IREF_3_RES = rcl:R-EU_: RESISTOR, European symbol; SPICEPREFIX: R
SHFT_REG_1-SHFT_REG_5 = 74xx:74*595: 8-bit SHIFT REGISTER, output latch
TLC_1-TLC_3 = tlc5940:TLC5940
U1 = _hhn_attiny25_45_85:ATTINY85*: ATMEL ATtiny 85 Packages: P = PDIP 08 30mil S = SOIC 08 EIAJ 208mil Technologies Note: for complete ordering code (temp. range, finish, tape&reel etc.) see www.atmel.com • Supply Voltage: V = (1.8…5.5)V | [blank] = (2.7…5.5)V • Speed: 10 = 10 MHz | 20 = 20 MHz Author: Dipl.-Ing. FH Rainer Bayer HHN Hochschule Heilbronn (Heilbronn University), rainer.bayer@hs-heilbronn.de Ingenieurbüro ing-rb, mail@ing-rb.de
U$1 = Arduino-clone:NANO: Arduino Nano

## Board
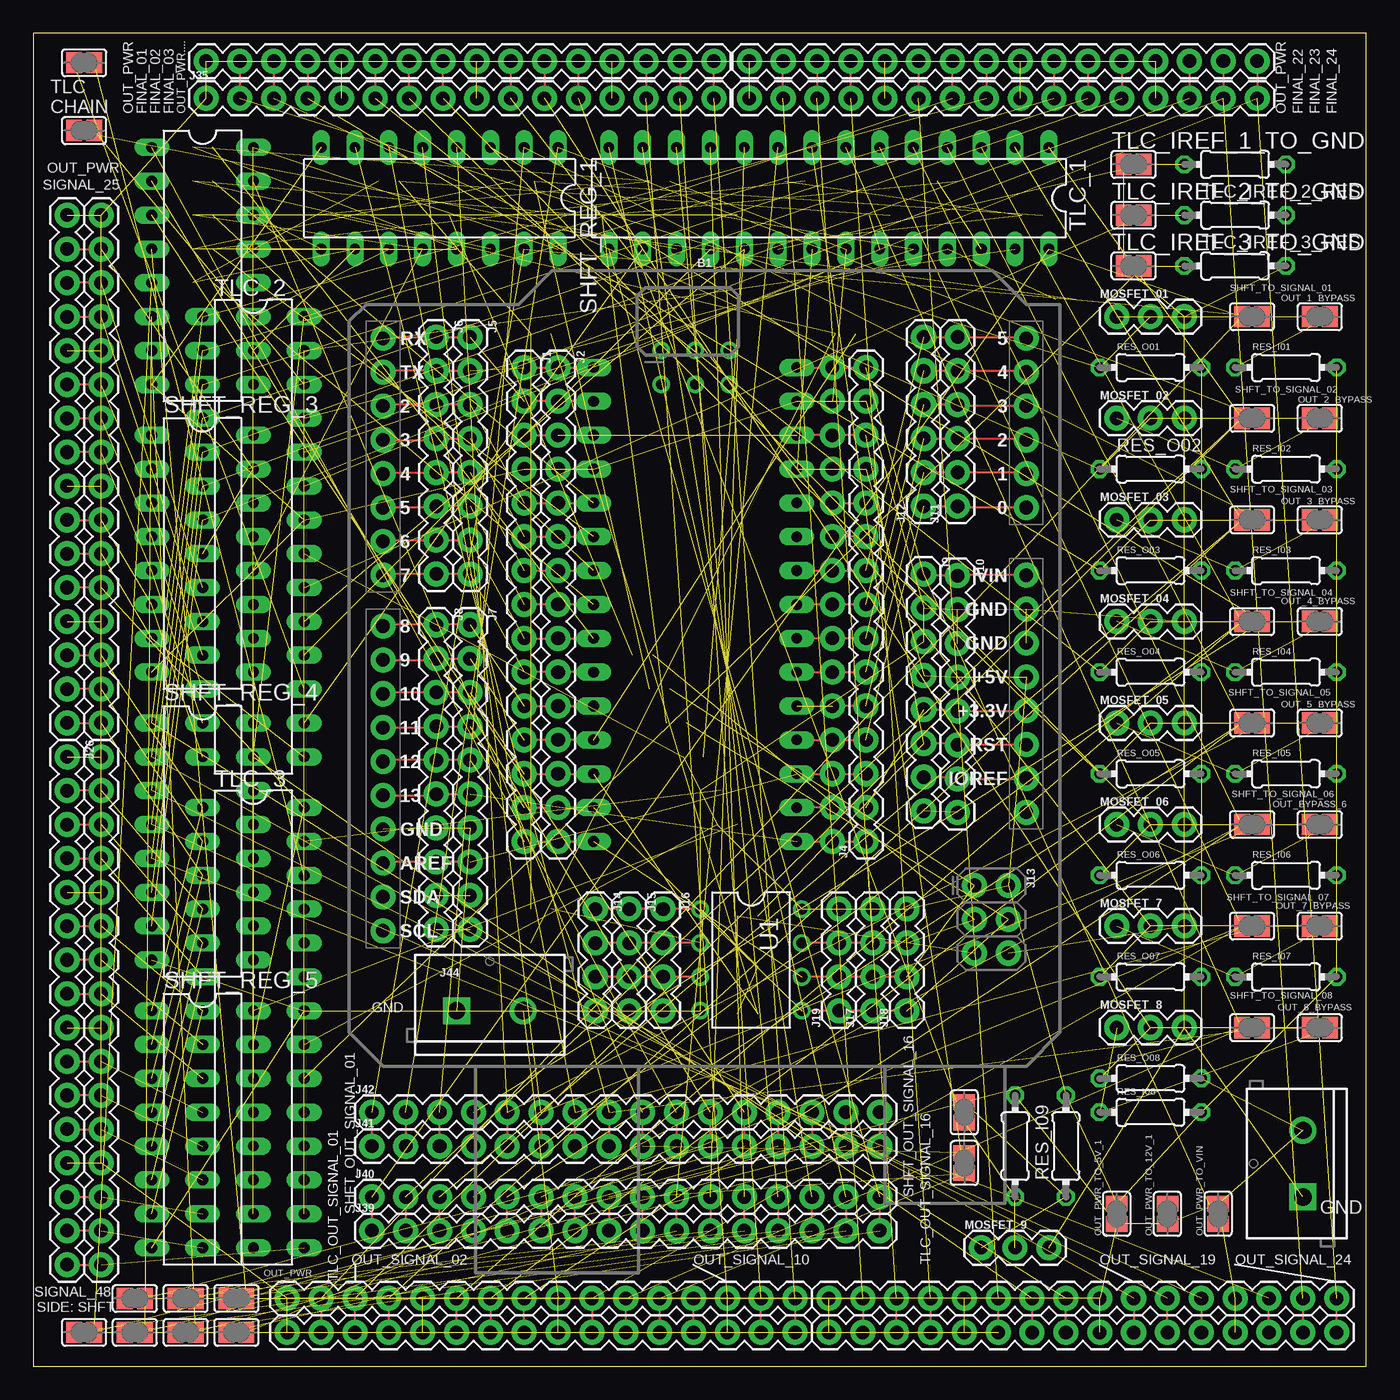
[diagram p5: board, top side]
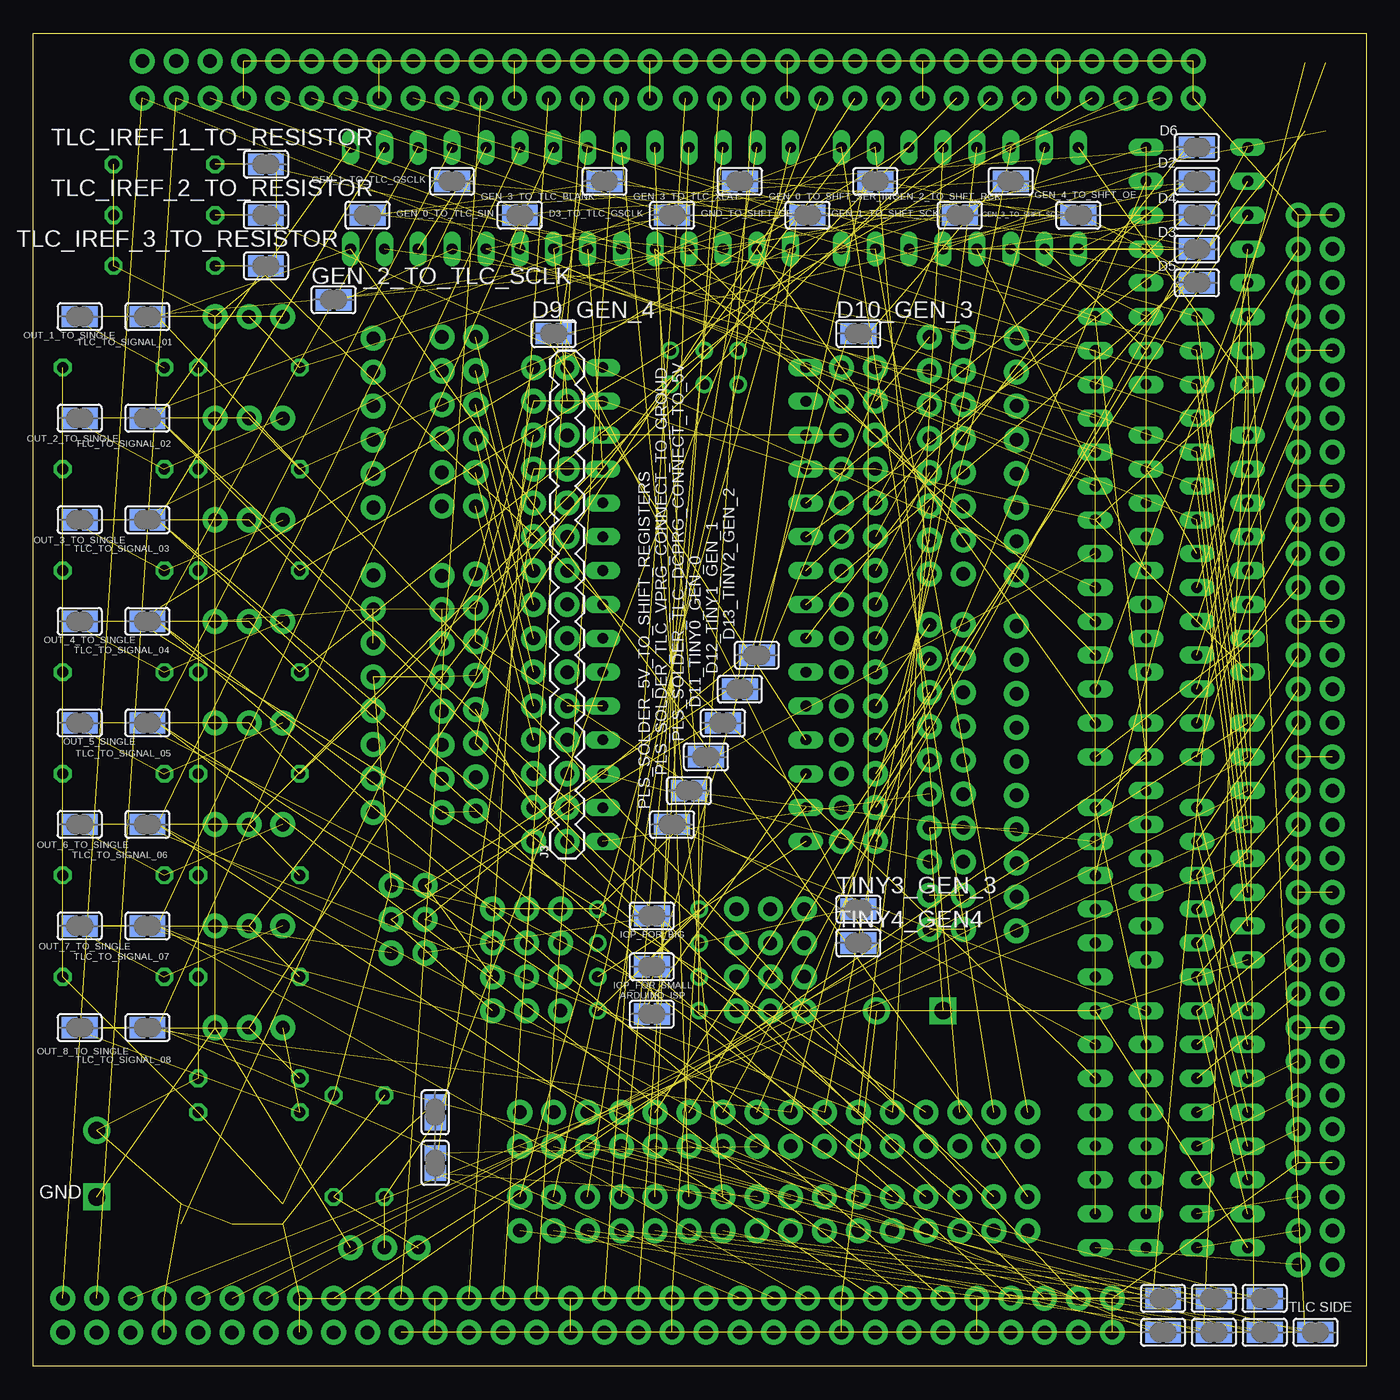
[diagram p6: board, bottom side, seen from below]

Size 100 x 100 mm. Coordinates in mm from the lower left corner, seen from the top.
Outline: 0,0 100,0 100,100 0,100 0,0
Copper layers (1*16): Top 0.035mm / dielectric 1.5mm / Bottom 0.035mm
Design rules "default": minimum track width 6mil, minimum drill 0.35mm, track to track 6mil, track to pad 6mil, pad to pad 6mil, via to via 6mil, smd to smd 6mil, copper to edge 40mil, drill to drill 6mil, minimum pad ring 10mil, minimum via ring 8mil, stop-mask expansion 4mil, vias tented up to drill 0mil, thermal gap 10mil

### Footprints (pad centres in the part's own frame; a part is rotated, then mirrored left to right if it is on the bottom)
SJ = smd 1.168 x 1.6: 1 -0.762,0; 2 0.762,0
UNO_R3_SHIELD = drill 1.016 pad 1.88: 3.3V 24.13,-2.54; 5V 24.13,0; A0 24.13,12.7; A1 24.13,15.24; A2 24.13,17.78; A3 24.13,20.32; A4 24.13,22.86; A5 24.13,25.4; AREF -24.13,-13.97; D2 -24.13,20.32; D3 -24.13,17.78; D4 -24.13,15.24; D5 -24.13,12.7; D6 -24.13,10.16; D7 -24.13,7.62; D8 -24.13,3.81; D9 -24.13,1.27; D10 -24.13,-1.27; D11 -24.13,-3.81; D12 -24.13,-6.35; D13 -24.13,-8.89; GND@0 24.13,2.54; GND@1 24.13,5.08; GND@2 -24.13,-11.43; IOREF 24.13,-7.62; NC 24.13,-10.16; RES 24.13,-5.08; RX -24.13,25.4; SCL -24.13,-19.05; SDA -24.13,-16.51; TX -24.13,22.86; VIN 24.13,7.62
1X15 = drill 1.016 pad 1.88: 1 0,0; 2 2.54,0; 3 5.08,0; 4 7.62,0; 5 10.16,0; 6 12.7,0; 7 15.24,0; 8 17.78,0; 9 20.32,0; 10 22.86,0; 11 25.4,0; 12 27.94,0; 13 30.48,0; 14 33.02,0; 15 35.56,0
1X08 = drill 1.016 pad 1.88: 1 0,0; 2 2.54,0; 3 5.08,0; 4 7.62,0; 5 10.16,0; 6 12.7,0; 7 15.24,0; 8 17.78,0
1X10 = drill 1.016 pad 1.88: 1 0,0; 2 2.54,0; 3 5.08,0; 4 7.62,0; 5 10.16,0; 6 12.7,0; 7 15.24,0; 8 17.78,0; 9 20.32,0; 10 22.86,0
1X06 = drill 1.016 pad 1.88: 1 0,0; 2 2.54,0; 3 5.08,0; 4 7.62,0; 5 10.16,0; 6 12.7,0
2X3-NS = drill 1.016 pad 1.88: 1 -2.54,-1.27; 2 -2.54,1.27; 3 0,-1.27; 4 0,1.27; 5 2.54,-1.27; 6 2.54,1.27
1X04 = drill 1.016 pad 1.88: 1 0,0; 2 2.54,0; 3 5.08,0; 4 7.62,0
1X16 = drill 1.016 pad 1.88: 1 0,0; 2 2.54,0; 3 5.08,0; 4 7.62,0; 5 10.16,0; 6 12.7,0; 7 15.24,0; 8 17.78,0; 9 20.32,0; 10 22.86,0; 11 25.4,0; 12 27.94,0; 13 30.48,0; 14 33.02,0; 15 35.56,0; 16 38.1,0
SCREWTERMINAL-5MM-2 = drill 1.3 pad 2.032 square: 1 0,0 | drill 1.3 pad 2.032: 2 5,0
1X03 = drill 1.016 pad 1.88: 1 0,0; 2 2.54,0; 3 5.08,0
0204/7 = drill 0.813 octagon: 1 -3.81,0; 2 3.81,0
DIL16 = drill 0.813 long: 1 -8.89,-3.81; 2 -6.35,-3.81; 3 -3.81,-3.81; 4 -1.27,-3.81; 5 1.27,-3.81; 6 3.81,-3.81; 7 6.35,-3.81; 8 8.89,-3.81; 9 8.89,3.81; 10 6.35,3.81; 11 3.81,3.81; 12 1.27,3.81; 13 -1.27,3.81; 14 -3.81,3.81; 15 -6.35,3.81; 16 -8.89,3.81
DIL28-3 = drill 0.813 long: 1 -16.51,-3.81; 2 -13.97,-3.81; 3 -11.43,-3.81; 4 -8.89,-3.81; 5 -6.35,-3.81; 6 -3.81,-3.81; 7 -1.27,-3.81; 8 1.27,-3.81; 9 3.81,-3.81; 10 6.35,-3.81; 11 8.89,-3.81; 12 11.43,-3.81; 13 13.97,-3.81; 14 16.51,-3.81; 15 16.51,3.81; 16 13.97,3.81; 17 11.43,3.81; 18 8.89,3.81; 19 6.35,3.81; 20 3.81,3.81; 21 1.27,3.81; 22 -1.27,3.81; 23 -3.81,3.81; 24 -6.35,3.81; 25 -8.89,3.81; 26 -11.43,3.81; 27 -13.97,3.81; 28 -16.51,3.81
PDIP08_300MIL = drill 0.813: 1 -3.81,-3.81; 2 -1.27,-3.81; 3 1.27,-3.81; 4 3.81,-3.81; 5 3.81,3.81; 6 1.27,3.81; 7 -1.27,3.81; 8 -3.81,3.81
NANO = drill 0.8 long: 3.3V -10.16,24.13; 5V -10.16,-1.27; A0 -10.16,19.05; A1 -10.16,16.51; A2 -10.16,13.97; A3 -10.16,11.43; A4 -10.16,8.89; A5 -10.16,6.35; A6 -10.16,3.81; A7 -10.16,1.27; AREF -10.16,21.59; D2 5.08,1.27; D3 5.08,3.81; D4 5.08,6.35; D5 5.08,8.89; D6 5.08,11.43; D7 5.08,13.97; D8 5.08,16.51; D9 5.08,19.05; D10 5.08,21.59; D11 5.08,24.13; D12 5.08,26.67; D13 -10.16,26.67; GND -10.16,-6.35; GND1 5.08,-1.27; RAW -10.16,-8.89; RST -10.16,-3.81; RST1 5.08,-3.81; RX1 5.08,-6.35; TX0 5.08,-8.89 | drill 0.8: ICSP1 -5.08,-10.16; ICSP2 -5.08,-7.62; ICSP3 -2.54,-10.16; ICSP4 -2.54,-7.62; ICSP5 0,-10.16; ICSP6 0,-7.62

### Placement (x,y rotation side)
ARDUINO_ISP  53.59,26.42 0 bottom
B1  50.36,51.72 0 top
D2_TO_SHFT_SER_IN  12.7,88.9 0 bottom
D3_TO_SHFT_SCK  12.7,83.82 0 bottom
D3_TO_TLC_GSCLK  57.15,88.9 0 bottom
D4_TO_SHFT_RCK  12.7,86.36 0 bottom
D5_TO_SHFT_SCL  12.7,81.28 0 bottom
D6_TO_SHFT_OE  12.7,91.44 0 bottom
D9_GEN_4  60.96,77.47 0 bottom
D10_GEN_3  38.1,77.47 0 bottom
D11_TINY0_GEN_0  48.26,48.26 0 bottom
D12_TINY1_GEN_1  46.99,50.8 0 bottom
D13_TINY2_GEN_2  45.72,53.34 0 bottom
GEN_0_TO_SHFT_SER_IN  41.91,86.36 0 bottom
GEN_0_TO_TLC_SIN  68.58,88.9 0 bottom
GEN_1_TO_SHFT_SCK  36.83,88.9 0 bottom
GEN_1_TO_TLC_GSCLK  74.93,86.36 0 bottom
GEN_2_TO_SHFT_RCK  30.48,86.36 0 bottom
GEN_2_TO_TLC_SCLK  77.47,80.01 0 bottom
GEN_3_TO_SHFT_SCL  26.67,88.9 0 bottom
GEN_3_TO_TLC_BLANK  63.5,86.36 0 bottom
GEN_3_TO_TLC_XLAT  52.07,86.36 0 bottom
GEN_4_TO_SHFT_OE  21.59,86.36 0 bottom
GND_TO_SHFT_OE  46.99,88.9 0 bottom
ICP_FOR_BIG  53.59,33.78 0 bottom
ICP_FOR_SMALL  53.59,29.97 0 bottom
J1  36.83,74.93 270 top
J2  39.37,74.93 270 top
J3  59.94,39.37 90 bottom
J4  62.48,39.37 90 top
J5  32.77,77.22 270 top
J6  30.23,77.22 270 top
J7  32.77,55.63 270 top
J8  30.23,55.63 270 top
J9  66.8,59.44 270 top
J10  69.34,59.31 270 top
J11  69.34,64.52 90 top
J12  66.8,64.52 90 top
J13  71.88,33.53 270 top
J14  42.16,34.29 270 top
J15  44.7,34.29 270 top
J16  47.24,34.29 270 top
J17  62.99,26.67 90 top
J18  65.53,26.67 90 top
J19  60.45,26.67 90 top
J20  19.05,2.54 0 top
J21  19.05,5.08 0 top
J22  59.69,5.08 0 top
J23  59.69,2.54 0 top
J24  5.08,86.36 270 top
J25  2.54,86.36 270 top
J26  2.54,45.72 270 top
J27  5.08,45.72 270 top
J35  12.95,95.12 0 top
J36  12.95,97.92 0 top
J37  53.72,97.92 0 top
J38  53.72,95.12 0 top
J39  25.4,10.16 0 top
J40  25.4,12.7 0 top
J41  25.4,16.51 0 top
J42  25.4,19.05 0 top
J43  95.25,12.7 90 top
J44  31.75,26.67 0 top
MOSFET_01  81.28,78.74 0 top
MOSFET_02  81.28,71.12 0 top
MOSFET_03  81.28,63.5 0 top
MOSFET_04  81.28,55.88 0 top
MOSFET_05  81.28,48.26 0 top
MOSFET_06  81.28,40.64 0 top
MOSFET_7  81.28,33.02 0 top
MOSFET_8  81.28,25.4 0 top
MOSFET_9  71.12,8.89 0 top
OUT_1_BYPASS  96.52,78.74 0 top
OUT_1_TO_SINGLE  96.52,78.74 180 bottom
OUT_2_BYPASS  96.52,71.12 0 top
OUT_2_TO_SINGLE  96.52,71.12 180 bottom
OUT_3_BYPASS  96.52,63.5 0 top
OUT_3_TO_SINGLE  96.52,63.5 180 bottom
OUT_4_BYPASS  96.52,55.88 0 top
OUT_4_TO_SINGLE  96.52,55.88 180 bottom
OUT_5_BYPASS  96.52,48.26 0 top
OUT_5_SINGLE  96.52,48.26 180 bottom
OUT_6_TO_SINGLE  96.52,40.64 180 bottom
OUT_7_BYPASS  96.52,33.02 0 top
OUT_7_TO_SINGLE  96.52,33.02 180 bottom
OUT_8_BYPASS  96.52,25.4 0 top
OUT_8_TO_SINGLE  96.52,25.4 180 bottom
OUT_9_BYPASS  69.85,19.05 90 top
OUT_9_TO_SINGLE  69.85,19.05 90 bottom
OUT_BYPASS_6  96.52,40.64 0 top
OUT_PWR_TO_5V_1  81.28,11.43 90 top
OUT_PWR_TO_12V_1  85.09,11.43 90 top
OUT_PWR_TO_VIN  88.9,11.43 90 top
PLS_SOLDER_5V_TO_SHIFT_REGISTERS  52.07,40.64 0 bottom
PLS_SOLDER_TLC_DCPRG_CONNECT_TO_5V  49.53,45.72 0 bottom
PLS_SOLDER_TLC_VPRG_CONNECT_TO_GROUD  50.8,43.18 0 bottom
RES_I01  93.98,74.93 0 top
RES_I02  93.98,67.31 0 top
RES_I03  93.98,59.69 0 top
RES_I04  93.98,52.07 0 top
RES_I05  93.98,44.45 0 top
RES_I06  93.98,36.83 0 top
RES_I07  93.98,29.21 0 top
RES_I08  83.82,19.05 0 top
RES_I09  77.47,16.51 90 top
RES_O01  83.82,74.93 0 top
RES_O02  83.82,67.31 0 top
RES_O03  83.82,59.69 0 top
RES_O04  83.82,52.07 0 top
RES_O05  83.82,44.45 0 top
RES_O06  83.82,36.83 0 top
RES_O07  83.82,29.21 0 top
RES_O08  83.82,21.59 0 top
RES_O09  73.66,16.51 90 top
SHFT_REG_1  30.48,87.63 180 top
SHFT_REG_2  12.7,82.55 270 top
SHFT_REG_3  12.7,60.96 270 top
SHFT_REG_4  12.7,39.37 270 top
SHFT_REG_5  12.7,17.78 270 top
SHFT_TO_SIGNAL_01  91.44,78.74 0 top
SHFT_TO_SIGNAL_02  91.44,71.12 0 top
SHFT_TO_SIGNAL_03  91.44,63.5 0 top
SHFT_TO_SIGNAL_04  91.44,55.88 0 top
SHFT_TO_SIGNAL_05  91.44,48.26 0 top
SHFT_TO_SIGNAL_06  91.44,40.64 0 top
SHFT_TO_SIGNAL_07  91.44,33.02 0 top
SHFT_TO_SIGNAL_08  91.44,25.4 0 top
SHFT_TO_SIGNAL_09  69.85,15.24 90 top
SHFT_TO_SIGNAL_10  15.24,2.54 0 top
SHFT_TO_SIGNAL_11  7.62,5.08 0 top
SHFT_TO_SIGNAL_12  11.43,5.08 0 top
SHFT_TO_SIGNAL_13  15.24,5.08 0 top
SHFT_TO_SIGNAL_14  3.81,2.54 0 top
SHFT_TO_SIGNAL_15  7.62,2.54 0 top
SHFT_TO_SIGNAL_16  11.43,2.54 0 top
TINY3_GEN_3  38.1,34.29 0 bottom
TINY4_GEN4  38.1,31.75 0 bottom
TLC_1  59.69,87.63 180 top
TLC_2  16.51,62.23 270 top
TLC_3  16.51,25.4 270 top
TLC_CHAIN_1_1  3.81,97.79 0 top
TLC_CHAIN_1_2  3.81,92.71 0 top
TLC_IREF_1_RES  90.17,90.17 0 top
TLC_IREF_1_TO_GND  82.55,90.17 0 top
TLC_IREF_1_TO_RESISTOR  82.55,90.17 180 bottom
TLC_IREF_2_RES  90.17,86.36 0 top
TLC_IREF_2_TO_GND  82.55,86.36 0 top
TLC_IREF_2_TO_RESISTOR  82.55,86.36 180 bottom
TLC_IREF_3_RES  90.17,82.55 0 top
TLC_IREF_3_TO_GND  82.55,82.55 0 top
TLC_IREF_3_TO_RESISTOR  82.55,82.55 180 bottom
TLC_TO_SIGNAL_01  91.44,78.74 180 bottom
TLC_TO_SIGNAL_02  91.44,71.12 180 bottom
TLC_TO_SIGNAL_03  91.44,63.5 180 bottom
TLC_TO_SIGNAL_04  91.44,55.88 180 bottom
TLC_TO_SIGNAL_05  91.44,48.26 180 bottom
TLC_TO_SIGNAL_06  91.44,40.64 180 bottom
TLC_TO_SIGNAL_07  91.44,33.02 180 bottom
TLC_TO_SIGNAL_08  91.44,25.4 180 bottom
TLC_TO_SIGNAL_09  69.85,15.24 90 bottom
TLC_TO_SIGNAL_10  15.24,2.54 180 bottom
TLC_TO_SIGNAL_11  7.62,5.08 180 bottom
TLC_TO_SIGNAL_12  11.43,5.08 180 bottom
TLC_TO_SIGNAL_13  15.24,5.08 180 bottom
TLC_TO_SIGNAL_14  3.81,2.54 180 bottom
TLC_TO_SIGNAL_15  7.62,2.54 180 bottom
TLC_TO_SIGNAL_16  11.43,2.54 180 bottom
U1  53.85,30.48 270 top
U$1  47.12,66.04 180 top

### Tracks (layer width: path | path; a pad name or v marks a point on that pad's centre or on a via)
+3.3V  (1 unrouted)
  Top 0.152: J4.2 J3.2 U$1.3.3V | J9.5 69.22,49.28 J10.5 74.46,49.15 B1.3.3V
+5V  (25 unrouted)
A0  (1 unrouted)
  Top 0.152: U$1.A0 J3.4 J4.4 | J12.1 J11.1 69.44,64.42 B1.A0
A1  (2 unrouted)
  Top 0.152: J4.5 J3.5 | B1.A1 74.39,67.06 J11.2 J12.2
A2  (1 unrouted)
  Top 0.152: U$1.A2 J3.6 J4.6 | J12.3 J11.3 74.39,69.6 B1.A2
A3  (1 unrouted)
  Top 0.152: J4.7 J3.7 U$1.A3 | B1.A3 69.44,72.04 J11.4 J12.4
A4  (1 unrouted)
  Top 0.152: J4.8 J3.8 U$1.A4 | J12.5 J11.5 74.39,74.68 B1.A4
A5  (1 unrouted)
  Top 0.152: U$1.A5 J3.9 J4.9 | J12.6 J11.6 74.39,77.22 B1.A5
AREF  (1 unrouted)
  Top 0.152: U$1.AREF J3.3 J4.3 | J7.8 J8.8 26.33,37.85 B1.AREF
AVRRST  (2 unrouted)
BIGRST  (3 unrouted)
  Top 0.152: J1.3 J2.3 | J4.13 J3.13 U$1.RST | B1.RES 74.46,46.61 J10.6 69.22,46.74 J9.6
D2  (2 unrouted)
  Top 0.152: J1.5 J2.5 U$1.D2 | J5.3 J6.3 26.33,72.14 B1.D2
D3  (3 unrouted)
  Top 0.152: J1.6 J2.6 U$1.D3 | B1.D3 30.13,69.5 J6.4 J5.4
D4  (2 unrouted)
  Top 0.152: J1.7 J2.7 U$1.D4 | J5.5 J6.5 26.33,67.06 B1.D4
D5  (2 unrouted)
  Top 0.152: U$1.D5 J2.8 J1.8 | J5.6 J6.6 30.13,64.42 B1.D5
D6  (2 unrouted)
  Top 0.152: J1.9 J2.9 U$1.D6 | B1.D6 26.33,61.98 J6.7 J5.7
D7  (1 unrouted)
  Top 0.152: U$1.D7 J2.10 J1.10 | J5.8 J6.8 26.33,59.44 B1.D7
D8  (1 unrouted)
  Top 0.152: J1.11 J2.11 U$1.D8 | J7.1 J8.1 26.33,55.63 B1.D8
D9  (2 unrouted)
  Top 0.152: U$1.D9 J2.12 J1.12 | B1.D9 30.13,52.99 J8.2 J7.2
D10  (3 unrouted)
  Top 0.152: J1.13 J2.13 U$1.D10 | J7.3 J8.3 26.33,50.55 B1.D10
D11  (4 unrouted)
  Top 0.152: J18.1 J17.1 J19.1 U1.5 | J1.14 J2.14 U$1.D11 | B1.D11 30.13,47.91 J8.4 J7.4
D12  (4 unrouted)
  Top 0.152: J18.2 J17.2 J19.2 U1.6 | J1.15 J2.15 U$1.D12 | J7.5 J8.5 26.33,45.47 B1.D12
D13  (4 unrouted)
  Top 0.152: J18.3 J17.3 J19.3 U1.7 | U$1.D13 J3.1 J4.1 | B1.D13 30.13,42.83 J8.6 J7.6
GENERAL_MCU_PIN_0  (2 unrouted)
GENERAL_MCU_PIN_1  (2 unrouted)
GENERAL_MCU_PIN_2  (2 unrouted)
GENERAL_MCU_PIN_3  (3 unrouted)
GENERAL_MCU_PIN_4  (3 unrouted)
GND  (46 unrouted)
IOREF
  Top 0.152: J9.7 69.22,44.2 J10.7 74.46,44.07 B1.IOREF
N$1  (1 unrouted)
N$5
  Top 0.152: J3.11 J4.11
N$6
  Top 0.152: J4.10 J3.10
N$14  (1 unrouted)
N$15  (1 unrouted)
N$50  (2 unrouted)
N$51  (2 unrouted)
N$54  (2 unrouted)
N$66  (2 unrouted)
N$70  (2 unrouted)
N$178  (2 unrouted)
N$182  (2 unrouted)
N$194  (2 unrouted)
N$198  (2 unrouted)
OUT_FINAL_01  (3 unrouted)
  Top 0.152: J36.2 J35.2
OUT_FINAL_02  (3 unrouted)
  Top 0.152: J36.3 J35.3
OUT_FINAL_03  (3 unrouted)
  Top 0.152: J36.4 J35.4
OUT_FINAL_04  (3 unrouted)
  Top 0.152: J36.6 J35.6
OUT_FINAL_05  (3 unrouted)
  Top 0.152: J35.7 J36.7
OUT_FINAL_06  (3 unrouted)
  Top 0.152: J35.8 J36.8
OUT_FINAL_07  (3 unrouted)
  Top 0.152: J36.10 J35.10
OUT_FINAL_08  (3 unrouted)
  Top 0.152: J36.11 J35.11
OUT_FINAL_09  (3 unrouted)
  Top 0.152: J35.12 J36.12
OUT_PWR  (60 unrouted)
  Top 0.152: J20.13 J21.13
OUT_SIGNAL_01  (4 unrouted)
  Top 0.152: J21.2 J20.2
OUT_SIGNAL_02  (4 unrouted)
  Top 0.152: J20.3 J21.3
OUT_SIGNAL_03  (4 unrouted)
  Top 0.152: J21.4 J20.4
OUT_SIGNAL_04  (4 unrouted)
  Top 0.152: J20.6 J21.6
OUT_SIGNAL_05  (4 unrouted)
  Top 0.152: J21.7 J20.7
OUT_SIGNAL_06  (4 unrouted)
  Top 0.152: J20.8 J21.8
OUT_SIGNAL_07  (4 unrouted)
  Top 0.152: J21.10 J20.10
OUT_SIGNAL_08  (4 unrouted)
  Top 0.152: J20.11 J21.11
OUT_SIGNAL_09  (4 unrouted)
  Top 0.152: J21.12 J20.12
OUT_SIGNAL_10  (4 unrouted)
  Top 0.152: J36.14 J35.14
OUT_SIGNAL_11  (3 unrouted)
  Top 0.152: J36.15 J35.15 | J20.15 J21.15
OUT_SIGNAL_12  (3 unrouted)
  Top 0.152: J35.16 J36.16 | J21.16 J20.16
OUT_SIGNAL_13  (3 unrouted)
  Top 0.152: J38.2 J37.2 | J22.2 J23.2
OUT_SIGNAL_14  (3 unrouted)
  Top 0.152: J37.3 J38.3 | J23.3 J22.3
OUT_SIGNAL_15  (3 unrouted)
  Top 0.152: J38.4 J37.4 | J22.4 J23.4
OUT_SIGNAL_16  (3 unrouted)
  Top 0.152: J37.6 J38.6 | J23.6 J22.6
OUT_SIGNAL_17  (3 unrouted)
  Top 0.152: J38.7 J37.7 | J22.7 J23.7
OUT_SIGNAL_18  (3 unrouted)
  Top 0.152: J37.8 J38.8 | J23.8 J22.8
OUT_SIGNAL_19  (3 unrouted)
  Top 0.152: J37.10 J38.10 | J22.10 J23.10
OUT_SIGNAL_20  (3 unrouted)
  Top 0.152: J37.11 J38.11 | J23.11 J22.11
OUT_SIGNAL_21  (3 unrouted)
  Top 0.152: J37.12 J38.12 | J22.12 J23.12
OUT_SIGNAL_22  (3 unrouted)
  Top 0.152: J37.14 J38.14 | J23.14 J22.14
OUT_SIGNAL_23  (3 unrouted)
  Top 0.152: J37.15 J38.15 | J22.15 J23.15
OUT_SIGNAL_24  (3 unrouted)
  Top 0.152: J37.16 J38.16 | J23.16 J22.16
OUT_SIGNAL_25  (2 unrouted)
  Top 0.152: J25.2 J24.2
OUT_SIGNAL_26  (2 unrouted)
  Top 0.152: J24.3 J25.3
OUT_SIGNAL_27  (2 unrouted)
  Top 0.152: J25.4 J24.4
OUT_SIGNAL_28  (2 unrouted)
  Top 0.152: J24.6 J25.6
OUT_SIGNAL_29  (2 unrouted)
  Top 0.152: J25.7 J24.7
OUT_SIGNAL_30  (2 unrouted)
  Top 0.152: J24.8 J25.8
OUT_SIGNAL_31  (2 unrouted)
  Top 0.152: J25.10 J24.10
OUT_SIGNAL_32  (2 unrouted)
  Top 0.152: J25.11 J24.11
OUT_SIGNAL_33  (2 unrouted)
  Top 0.152: J24.12 J25.12
OUT_SIGNAL_34  (2 unrouted)
  Top 0.152: J25.14 J24.14
OUT_SIGNAL_35  (2 unrouted)
  Top 0.152: J24.15 J25.15
OUT_SIGNAL_36  (2 unrouted)
  Top 0.152: J25.16 J24.16
OUT_SIGNAL_37  (2 unrouted)
  Top 0.152: J27.2 J26.2
OUT_SIGNAL_38  (2 unrouted)
  Top 0.152: J26.3 J27.3
OUT_SIGNAL_39  (2 unrouted)
  Top 0.152: J26.4 J27.4
OUT_SIGNAL_40  (2 unrouted)
  Top 0.152: J26.6 J27.6
OUT_SIGNAL_41  (1 unrouted)
  Top 0.152: J27.7 J26.7
OUT_SIGNAL_42  (1 unrouted)
  Top 0.152: J26.8 J27.8
OUT_SIGNAL_43  (1 unrouted)
  Top 0.152: J26.10 J27.10
OUT_SIGNAL_44  (1 unrouted)
  Top 0.152: J27.11 J26.11
OUT_SIGNAL_45  (1 unrouted)
  Top 0.152: J26.12 J27.12
OUT_SIGNAL_46  (1 unrouted)
  Top 0.152: J26.14 J27.14
OUT_SIGNAL_47  (1 unrouted)
  Top 0.152: J27.15 J26.15
OUT_SIGNAL_48  (1 unrouted)
  Top 0.152: J26.16 J27.16
RX  (1 unrouted)
  Top 0.152: U$1.RX1 J2.2 J1.2 | B1.RX 26.33,77.22 J6.1 J5.1
SHFT_OUT_SIGNAL_01  (2 unrouted)
  Top 0.152: J41.1 J42.1
SHFT_OUT_SIGNAL_02  (2 unrouted)
  Top 0.152: J42.2 J41.2
SHFT_OUT_SIGNAL_03  (2 unrouted)
  Top 0.152: J41.3 J42.3
SHFT_OUT_SIGNAL_04  (2 unrouted)
  Top 0.152: J42.4 J41.4
SHFT_OUT_SIGNAL_05  (2 unrouted)
  Top 0.152: J42.5 J41.5
SHFT_OUT_SIGNAL_06  (2 unrouted)
  Top 0.152: J42.6 J41.6
SHFT_OUT_SIGNAL_07  (2 unrouted)
  Top 0.152: J41.7 J42.7
SHFT_OUT_SIGNAL_08  (2 unrouted)
  Top 0.152: J42.8 J41.8
SHFT_OUT_SIGNAL_09  (2 unrouted)
  Top 0.152: J41.9 J42.9
SHFT_OUT_SIGNAL_10  (2 unrouted)
  Top 0.152: J42.10 J41.10
SHFT_OUT_SIGNAL_11  (2 unrouted)
  Top 0.152: J41.11 J42.11
SHFT_OUT_SIGNAL_12  (2 unrouted)
  Top 0.152: J41.12 J42.12
SHFT_OUT_SIGNAL_13  (2 unrouted)
  Top 0.152: J42.13 J41.13
SHFT_OUT_SIGNAL_14  (2 unrouted)
  Top 0.152: J42.14 J41.14
SHFT_OUT_SIGNAL_15  (2 unrouted)
  Top 0.152: J41.15 J42.15
SHFT_OUT_SIGNAL_16  (2 unrouted)
  Top 0.152: J41.16 J42.16
SHFT_REG_1_OUT  (1 unrouted)
SHFT_REG_2_OUT  (1 unrouted)
SHFT_REG_3_SOUT  (1 unrouted)
SHFT_REG_4_SOUT  (1 unrouted)
SHFT_REG_OE  (7 unrouted)
SHFT_REG_RCK  (5 unrouted)
SHFT_REG_SCK  (6 unrouted)
SHFT_REG_SCL  (6 unrouted)
SHFT_REG_SERIAL_IN  (2 unrouted)
TINY03  (1 unrouted)
  Top 0.152: U1.2 J16.2 J15.2 J14.2
TINY04
  Top 0.152: U1.3 J16.3 J15.3 J14.3
TINYRST  (2 unrouted)
  Top 0.152: U1.1 J16.1 J15.1 J14.1
TLC_BLANK  (3 unrouted)
TLC_DCPRG  (3 unrouted)
TLC_GSCLK  (4 unrouted)
TLC_IREF_1  (2 unrouted)
TLC_IREF_1_RESISTOR  (1 unrouted)
TLC_IREF_2  (2 unrouted)
TLC_IREF_2_RESISTOR  (1 unrouted)
TLC_IREF_3  (2 unrouted)
TLC_IREF_3_RESISTOR  (1 unrouted)
TLC_OUT_SIGNAL_01  (2 unrouted)
  Top 0.152: J39.1 J40.1
TLC_OUT_SIGNAL_02  (2 unrouted)
  Top 0.152: J40.2 J39.2
TLC_OUT_SIGNAL_03  (2 unrouted)
  Top 0.152: J39.3 J40.3
TLC_OUT_SIGNAL_04  (2 unrouted)
  Top 0.152: J40.4 J39.4
TLC_OUT_SIGNAL_05  (2 unrouted)
  Top 0.152: J39.5 J40.5
TLC_OUT_SIGNAL_06  (2 unrouted)
  Top 0.152: J40.6 J39.6
TLC_OUT_SIGNAL_07  (2 unrouted)
  Top 0.152: J39.7 J40.7
TLC_OUT_SIGNAL_08  (2 unrouted)
  Top 0.152: J40.8 J39.8
TLC_OUT_SIGNAL_09  (2 unrouted)
  Top 0.152: J39.9 J40.9
TLC_OUT_SIGNAL_10  (2 unrouted)
  Top 0.152: J39.10 J40.10
TLC_OUT_SIGNAL_11  (2 unrouted)
  Top 0.152: J40.11 J39.11
TLC_OUT_SIGNAL_12  (2 unrouted)
  Top 0.152: J39.12 J40.12
TLC_OUT_SIGNAL_13  (2 unrouted)
  Top 0.152: J40.13 J39.13
TLC_OUT_SIGNAL_14  (2 unrouted)
  Top 0.152: J39.14 J40.14
TLC_OUT_SIGNAL_15  (2 unrouted)
  Top 0.152: J40.15 J39.15
TLC_OUT_SIGNAL_16  (2 unrouted)
  Top 0.152: J39.16 J40.16
TLC_SCLK  (3 unrouted)
TLC_SIN_1  (1 unrouted)
TLC_SIN_2  (1 unrouted)
TLC_SIN_3  (1 unrouted)
TLC_SOUT_1  (1 unrouted)
TLC_SOUT_2  (1 unrouted)
TLC_VPRG  (3 unrouted)
TLC_XERR  (2 unrouted)
TLC_XLAT  (3 unrouted)
TX  (1 unrouted)
  Top 0.152: J1.1 J2.1 U$1.TX0 | B1.TX 26.33,74.68 J6.2 J5.2
VCC  (5 unrouted)
VIN  (2 unrouted)
  Top 0.152: U$1.RAW J3.15 J4.15 | B1.VIN 69.37,59.34 J10.1 66.93,59.31 J9.1

### Text on the board
tNames: TLC / CHAIN | OUT_PWR | FINAL_01 | FINAL_02 | FINAL_03 | OUT_PWR.... | OUT_PWR | FINAL_22 | FINAL_23 | FINAL_24 | OUT_PWR | SIGNAL_25 | GND | SHFT_OUT_SIGNAL_16 | SHFT_OUT_SIGNAL_01 | GND | OUT_SIGNAL_02 | OUT_SIGNAL_10 | TLC_OUT_SIGNAL_16 | OUT_SIGNAL_19 | OUT_SIGNAL_24 | OUT_PWR | SIGNAL_48 | TLC_OUT_SIGNAL_01 | SIDE: SHFT
bNames: D6 | D2 | D4 | D3 | D5 | GND | TLC SIDE